# EAGLE schematic Mainboard_3.6 (EAGLE 9.6.2), part 1 of 4
Assembly variants: A, B
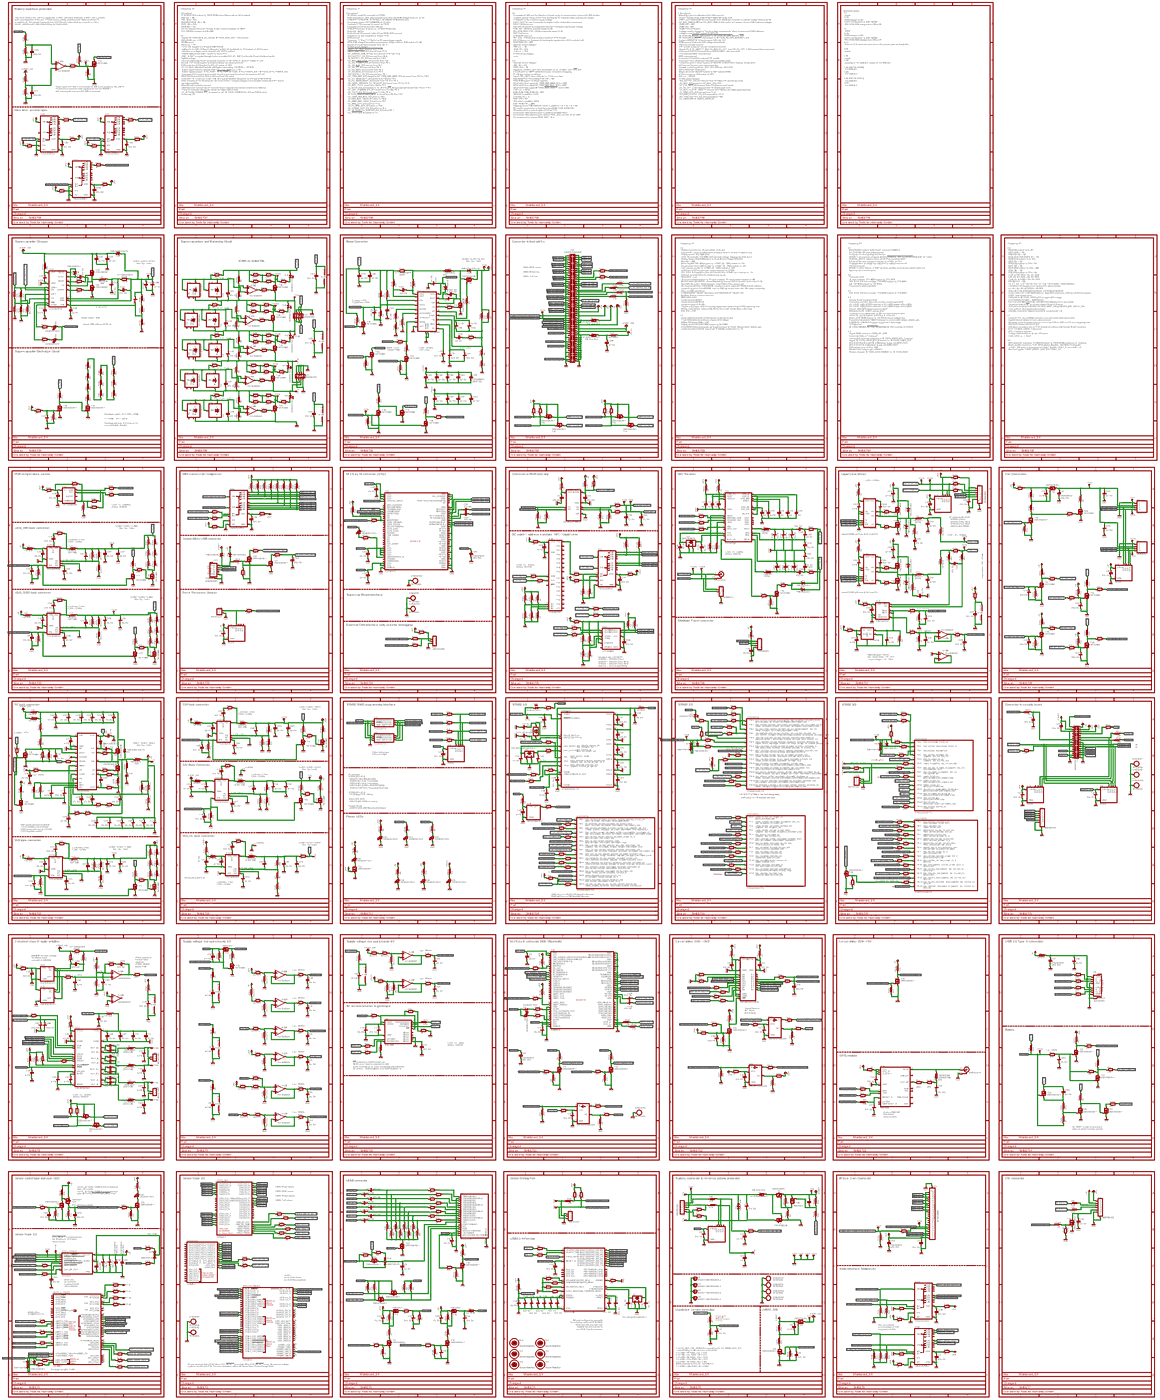
[diagram p0: schematic, sheet 1, overview]
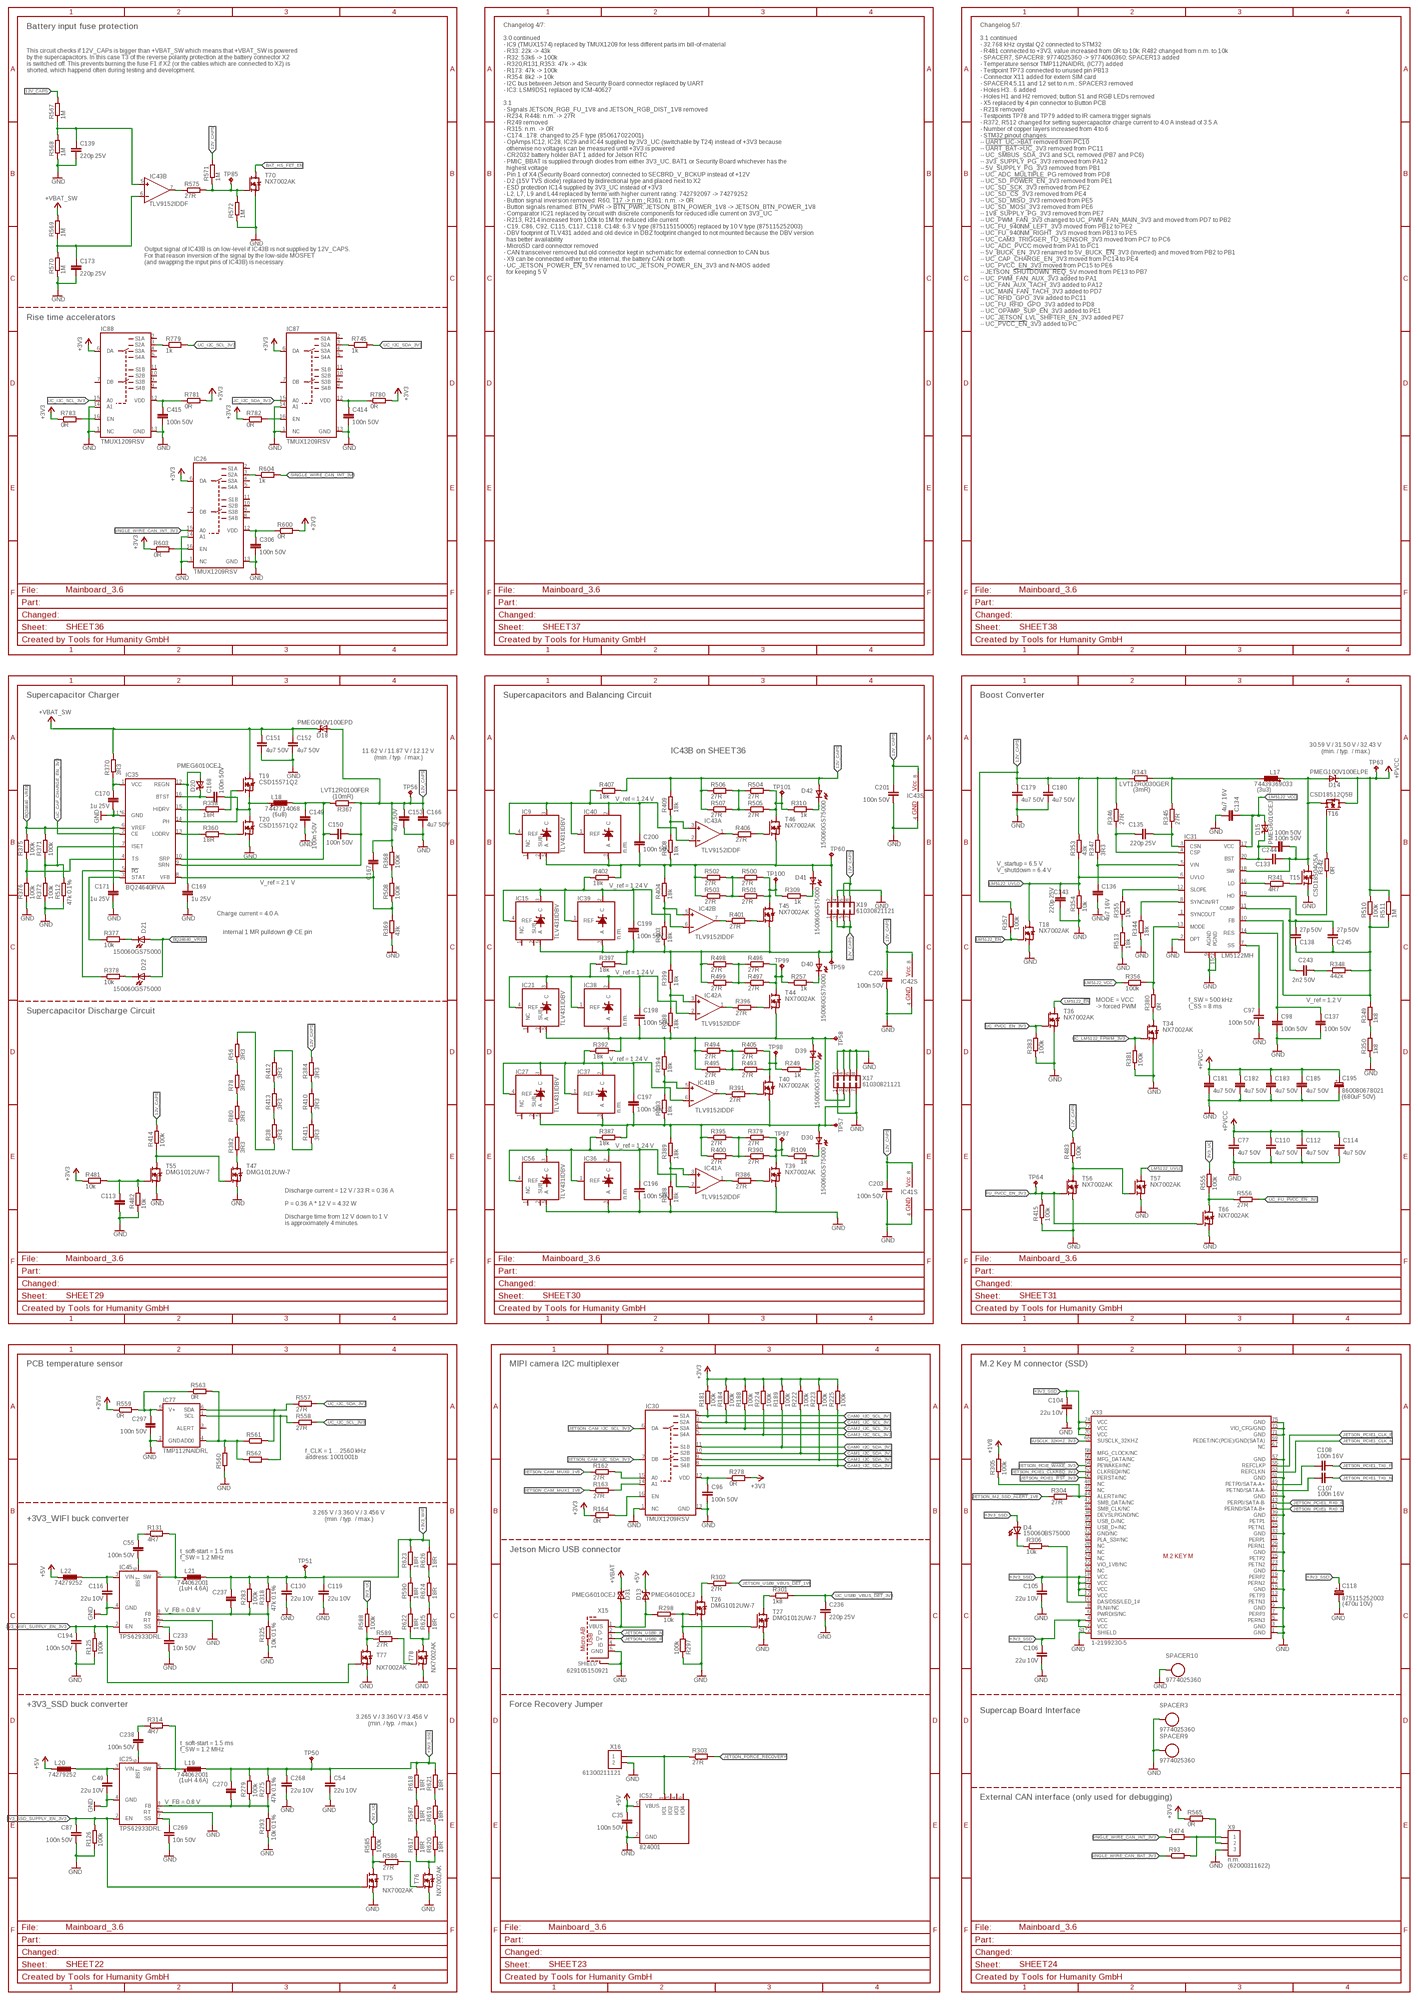
[diagram p1: schematic, sheet 1, part 1 of 4]
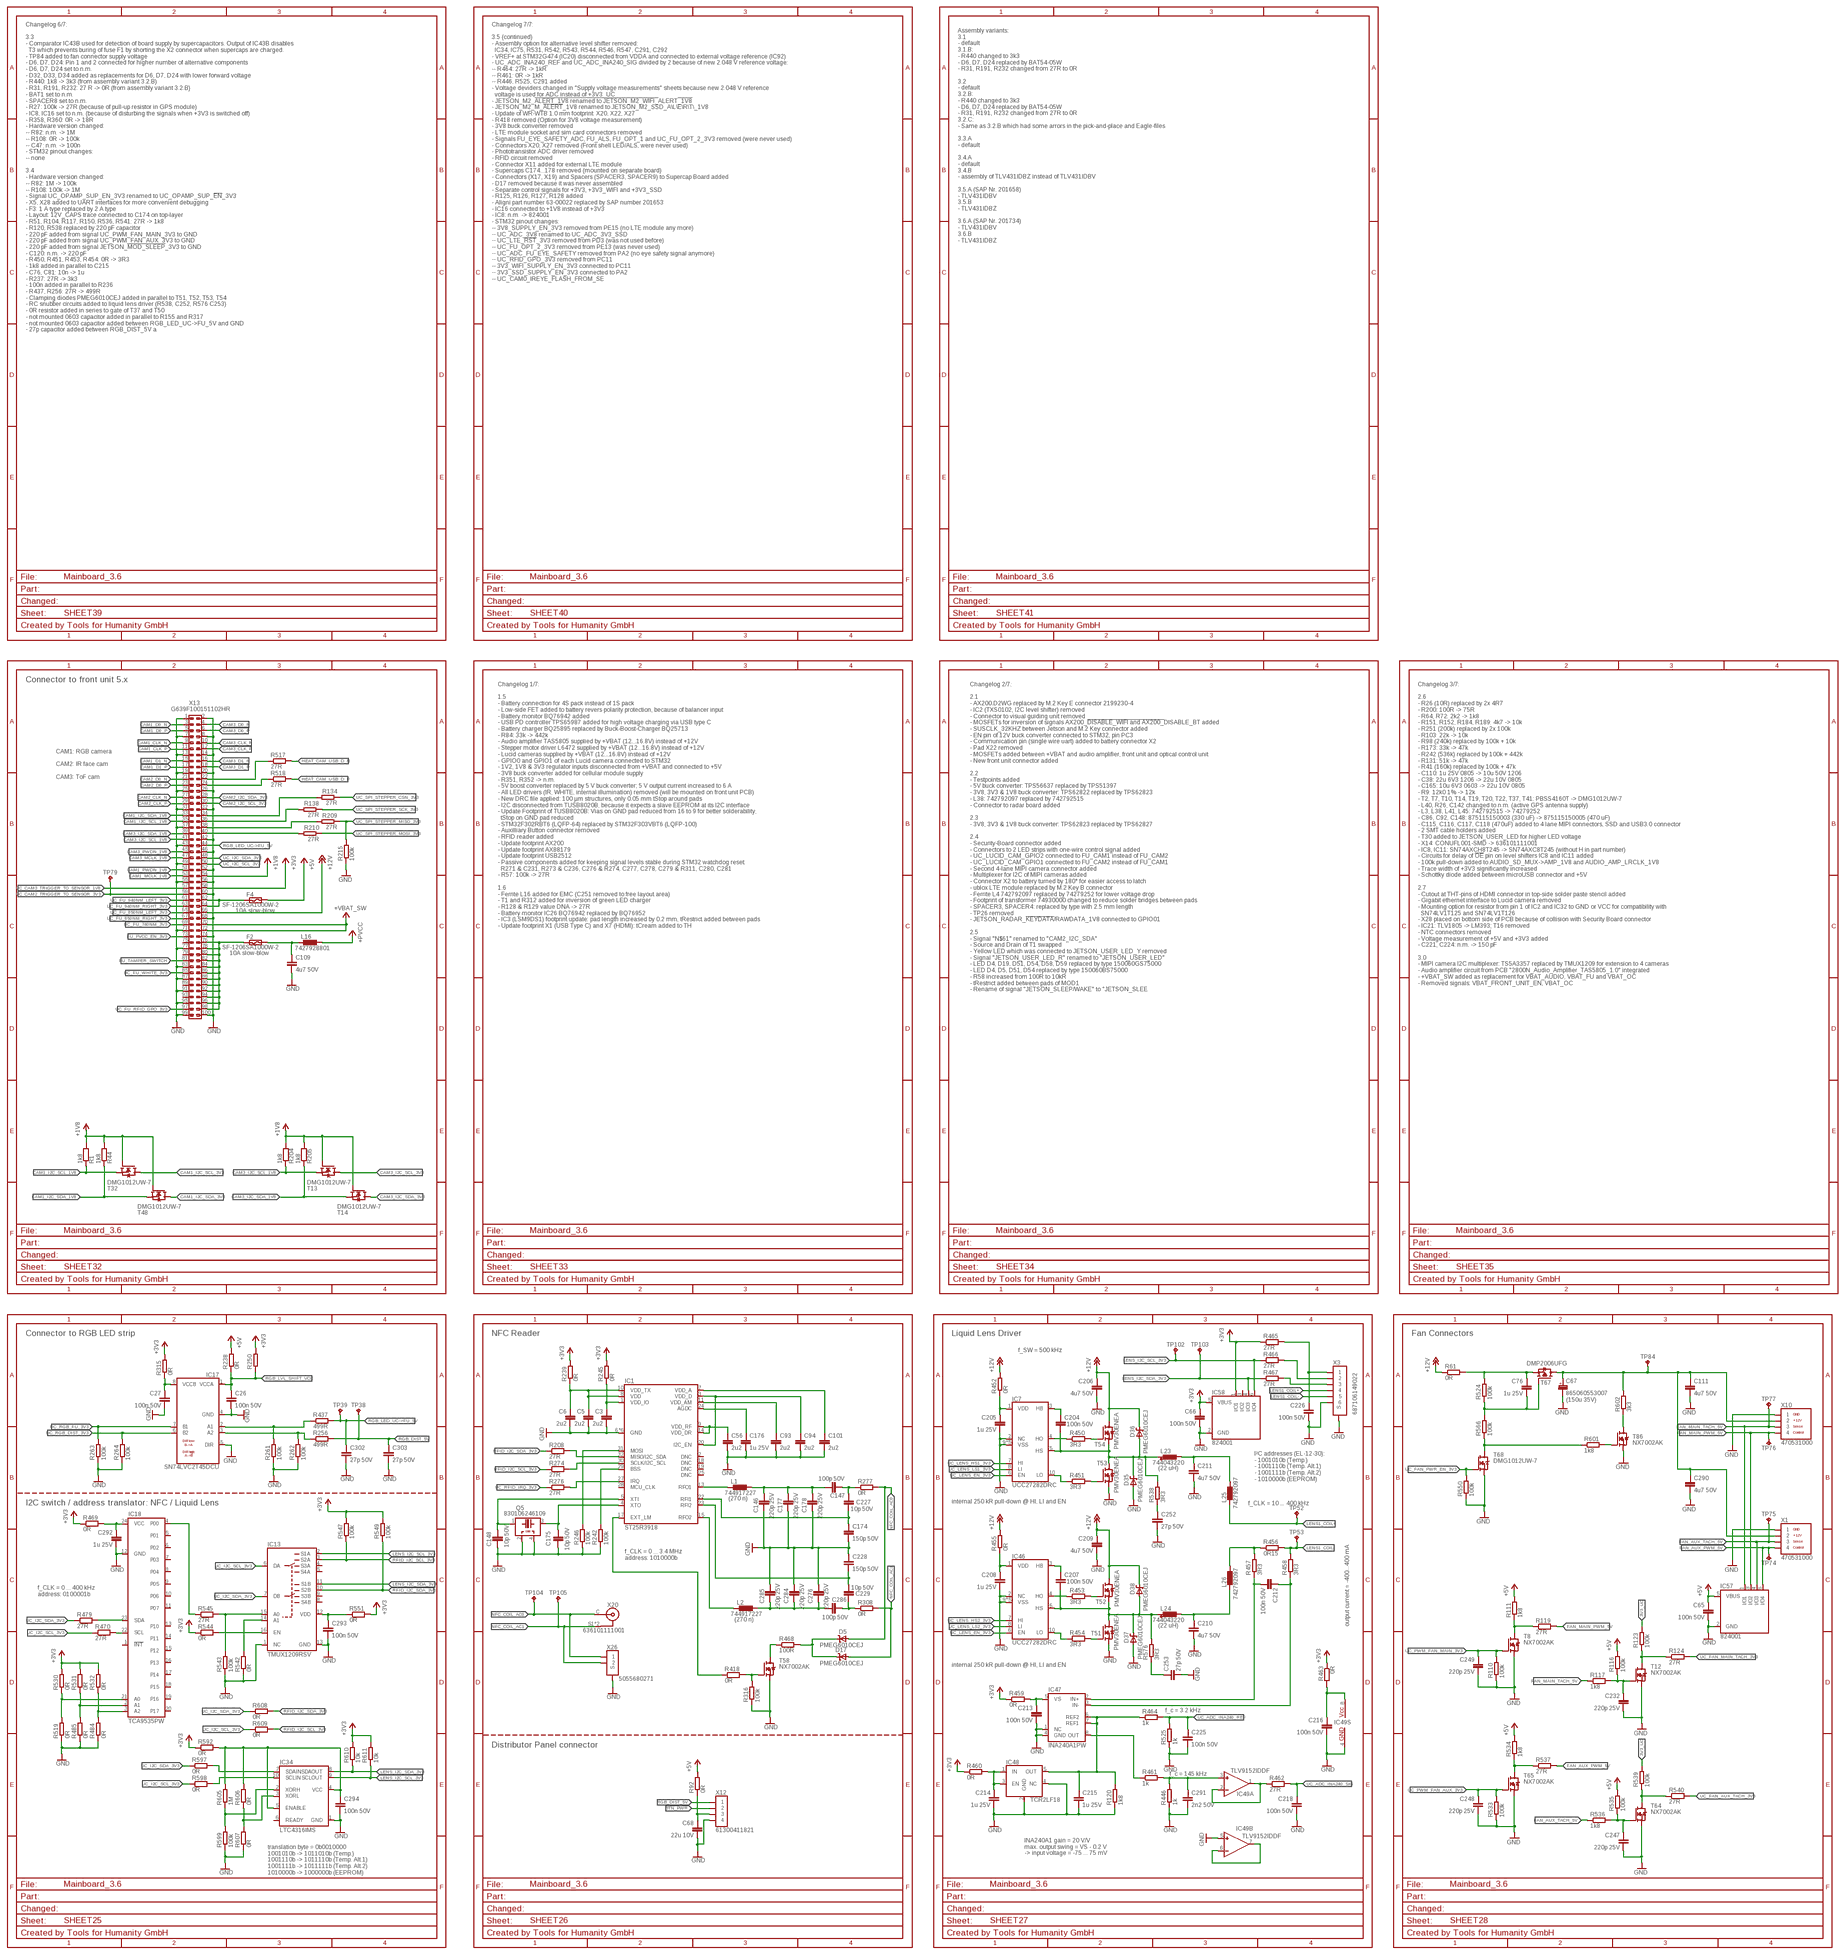
[diagram p2: schematic, sheet 1, part 2 of 4]
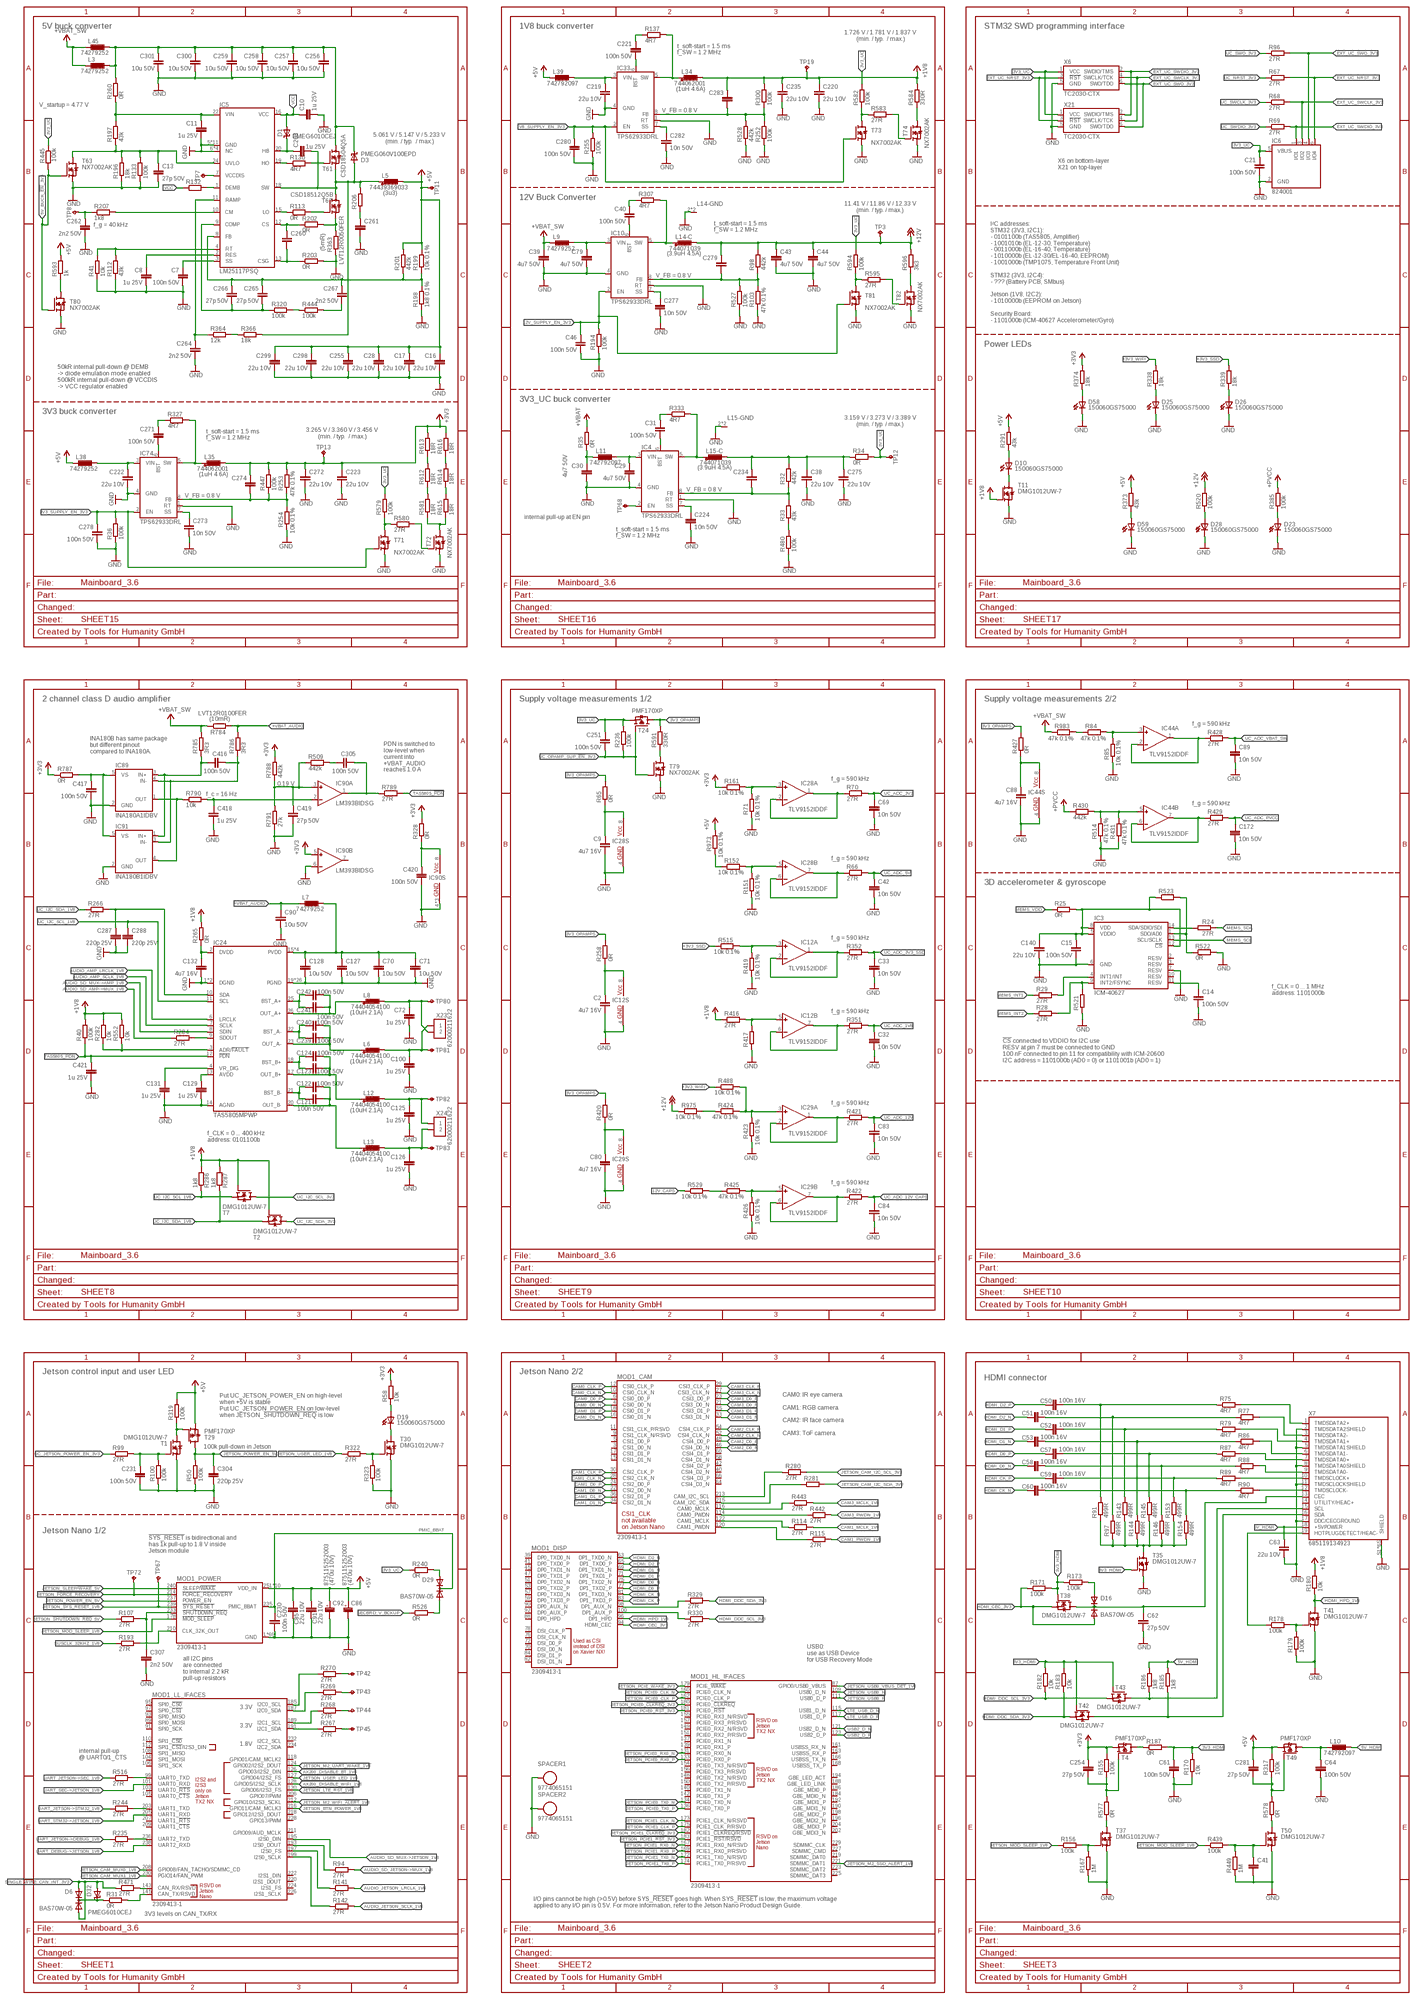
[diagram p3: schematic, sheet 1, part 3 of 4]
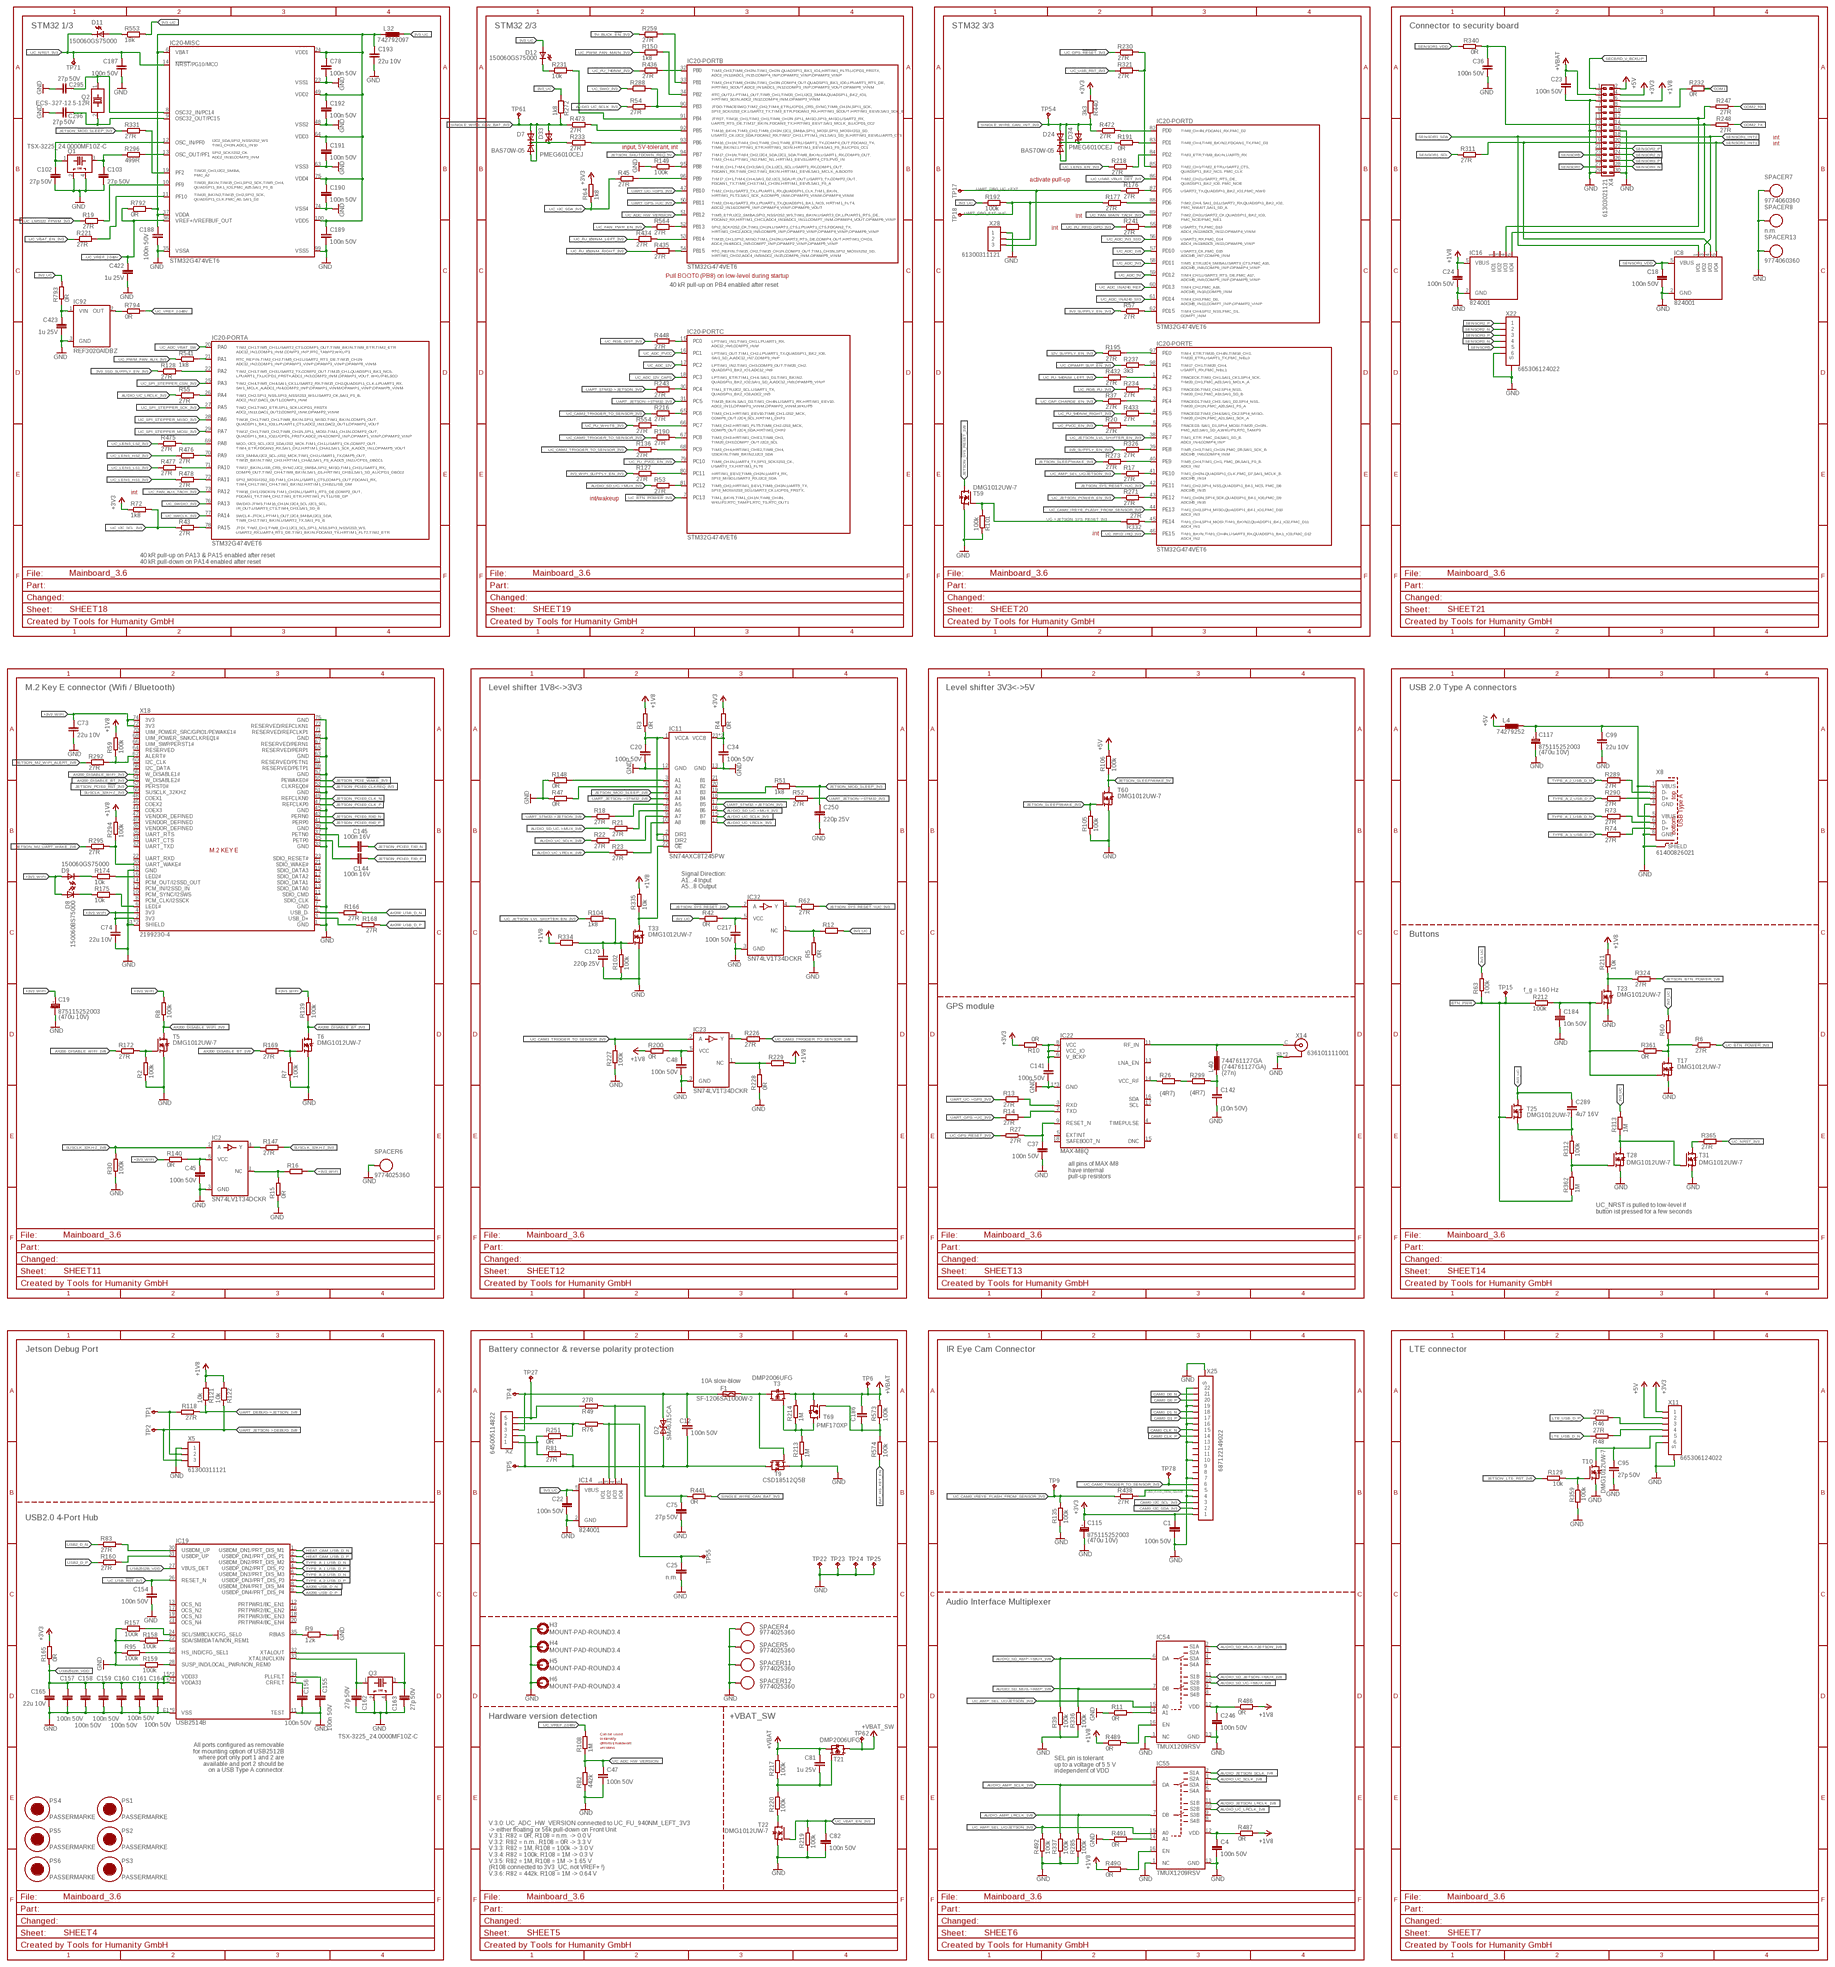
[diagram p4: schematic, sheet 1, part 4 of 4]

## Parts
C1  100n 50V  C-EU-100N-C0603  [C0603]
C2  4u7 16V  C-EU-4U7-C0805  [C0805]
C3  2u2  C-EU-2U2-C0603  [C0603]
C4  100n 50V  C-EU-100N-C0603  [C0603]
C5  2u2  C-EU-2U2-C0603  [C0603]
C6  2u2  C-EU-2U2-C0603  [C0603]
C7  100n 50V  C-EU-100N-C0603  [C0603]
C8  1u 25V  C-EU-1U-C0805  [C0805]
C9  4u7 16V  C-EU-4U7-C0805  [C0805]
C10  1u 25V  C-EU-1U-C0805  [C0805]
C11  1u 25V  C-EU-1U-C0805  [C0805]
C12  100n 50V  C-EU-100N-C0603  [C0603]
C13  27p 50V  C-EU-27P-C0603  [C0603]
C14  100n 50V  C-EU-100N-C0603  [C0603]
C15  100n 50V  C-EU-100N-C0603  [C0603]
C16  22u 10V  C-EU-22U-C0805  [C0805]
C17  22u 10V  C-EU-22U-C0805  [C0805]
C18  100n 50V  C-EU-100N-C0603  [C0603]
C19  875115252003  [WCAP-PSHP_8.0X8.7_WE]
C20  100n 50V  C-EU-100N-C0603  [C0603]
C21  100n 50V  C-EU-100N-C0603  [C0603]
C22  100n 50V  C-EU-100N-C0603  [C0603]
C23  100n 50V  C-EU-100N-C0603  [C0603]
C24  100n 50V  C-EU-100N-C0603  [C0603]
C25  n.m.  C-EU-C0402  [C0402]  (not fitted in variant A)  (not fitted in variant B)
C26  100n 50V  C-EU-100N-C0603  [C0603]
C27  100n 50V  C-EU-100N-C0603  [C0603]
C28  22u 10V  C-EU-22U-C0805  [C0805]
C29  4u7 50V  C-EU-4U7-50V-C1210  [C1210]
C30  4u7 50V  C-EU-4U7-50V-C1210  [C1210]
C31  100n 50V  C-EU-100N-C0603  [C0603]
C32  10n 50V  C-EU-10N-C0603  [C0603]
C33  10n 50V  C-EU-10N-C0603  [C0603]
C34  100n 50V  C-EU-100N-C0603  [C0603]
C35  100n 50V  C-EU-100N-C0603  [C0603]
C36  100n 50V  C-EU-100N-C0603  [C0603]
C37  100n 50V  C-EU-100N-C0603  [C0603]
C38  22u 10V  C-EU-22U-C0805  [C0805]
C39  4u7 50V  C-EU-4U7-50V-C1210  [C1210]
C40  100n 50V  C-EU-100N-C0603  [C0603]
C41  C-EU-C0603  [C0603]  (not fitted in variant A)  (not fitted in variant B)
C42  10n 50V  C-EU-10N-C0603  [C0603]
C43  4u7 50V  C-EU-4U7-50V-C1210  [C1210]
C44  4u7 50V  C-EU-4U7-50V-C1210  [C1210]
C45  100n 50V  C-EU-100N-C0603  [C0603]
C46  100n 50V  C-EU-100N-C0603  [C0603]
C47  100n 50V  C-EU-100N-C0603  [C0603]
C48  100n 50V  C-EU-100N-C0603  [C0603]
C49  22u 10V  C-EU-22U-C0805  [C0805]
C50  100n 16V  C-EU-100N-C0402  [C0402]
C51  100n 16V  C-EU-100N-C0402  [C0402]
C52  100n 16V  C-EU-100N-C0402  [C0402]
C53  100n 16V  C-EU-100N-C0402  [C0402]
C54  22u 10V  C-EU-22U-C0805  [C0805]
C55  100n 50V  C-EU-100N-C0603  [C0603]
C56  2u2  C-EU-2U2-C0603  [C0603]
C57  100n 16V  C-EU-100N-C0402  [C0402]
C58  100n 16V  C-EU-100N-C0402  [C0402]
C59  100n 16V  C-EU-100N-C0402  [C0402]
C60  100n 16V  C-EU-100N-C0402  [C0402]
C61  100n 50V  C-EU-100N-C0603  [C0603]
C62  27p 50V  C-EU-27P-C0603  [C0603]
C63  22u 10V  C-EU-22U-C0805  [C0805]
C64  100n 50V  C-EU-100N-C0603  [C0603]
C65  100n 50V  C-EU-100N-C0603  [C0603]
C66  100n 50V  C-EU-100N-C0603  [C0603]
C67  865060553007  [WCAP-ASLL_8.0X10.5_WE]
C68  22u 10V  C-EU-22U-C0805  [C0805]
C69  10n 50V  C-EU-10N-C0603  [C0603]
C70  10u 50V  C-EU-10U-C1206  [C1206]
C71  10u 50V  C-EU-10U-C1206  [C1206]
C72  1u 25V  C-EU-1U-C0805  [C0805]
C73  22u 10V  C-EU-22U-C0805  [C0805]
C74  22u 10V  C-EU-22U-C0805  [C0805]
C75  27p 50V  C-EU-27P-C0603  [C0603]
C76  1u 25V  C-EU-1U-C0805  [C0805]
C77  4u7 50V  C-EU-4U7-50V-C1210  [C1210]
C78  100n 50V  C-EU-100N-C0603  [C0603]
C79  4u7 50V  C-EU-4U7-50V-C1210  [C1210]
C80  4u7 16V  C-EU-4U7-C0805  [C0805]
C81  1u 25V  C-EU-1U-C0805  [C0805]
C82  100n 50V  C-EU-100N-C0603  [C0603]
C83  10n 50V  C-EU-10N-C0603  [C0603]
C84  10n 50V  C-EU-10N-C0603  [C0603]
C85  22u 10V  C-EU-22U-C0805  [C0805]
C86  875115252003  [WCAP-PSHP_8.0X8.7_WE]
C87  100n 50V  C-EU-100N-C0603  [C0603]
C88  4u7 16V  C-EU-4U7-C0805  [C0805]
C89  10n 50V  C-EU-10N-C0603  [C0603]
C90  10u 50V  C-EU-10U-C1206  [C1206]
C91  22u 10V  C-EU-22U-C0805  [C0805]
C92  875115252003  [WCAP-PSHP_8.0X8.7_WE]
C93  2u2  C-EU-2U2-C0603  [C0603]
C94  2u2  C-EU-2U2-C0603  [C0603]
C95  27p 50V  C-EU-27P-C0603  [C0603]
C96  100n 50V  C-EU-100N-C0603  [C0603]
C97  100n 50V  C-EU-100N-C0603  [C0603]
C98  100n 50V  C-EU-100N-C0603  [C0603]
C99  22u 10V  C-EU-22U-C0805  [C0805]
C100  1u 25V  C-EU-1U-C0805  [C0805]
C101  2u2  C-EU-2U2-C0603  [C0603]
C102  27p 50V  C-EU-27P-C0603  [C0603]
C103  27p 50V  C-EU-27P-C0603  [C0603]
C104  22u 10V  C-EU-22U-C0805  [C0805]
C105  22u 10V  C-EU-22U-C0805  [C0805]
C106  22u 10V  C-EU-22U-C0805  [C0805]
C107  100n 16V  C-EU-100N-C0402  [C0402]
C108  100n 16V  C-EU-100N-C0402  [C0402]
C109  4u7 50V  C-EU-4U7-50V-C1210  [C1210]
C110  4u7 50V  C-EU-4U7-50V-C1210  [C1210]
C111  4u7 50V  C-EU-4U7-50V-C1210  [C1210]
C112  4u7 50V  C-EU-4U7-50V-C1210  [C1210]
C113  C-EU-C0603  [C0603]  (not fitted in variant A)  (not fitted in variant B)
C114  4u7 50V  C-EU-4U7-50V-C1210  [C1210]
C115  875115252003  [WCAP-PSHP_8.0X8.7_WE]
C116  22u 10V  C-EU-22U-C0805  [C0805]
C117  875115252003  [WCAP-PSHP_8.0X8.7_WE]
C118  875115252003  [WCAP-PSHP_8.0X8.7_WE]
C119  22u 10V  C-EU-22U-C0805  [C0805]
C120  220p 25V  C-EU-220P-C0402  [C0402]
C121  100n 50V  C-EU-100N-C0603  [C0603]
C122  100n 50V  C-EU-100N-C0603  [C0603]
C123  100n 50V  C-EU-100N-C0603  [C0603]
C124  100n 50V  C-EU-100N-C0603  [C0603]
C125  1u 25V  C-EU-1U-C0805  [C0805]
C126  1u 25V  C-EU-1U-C0805  [C0805]
C127  10u 50V  C-EU-10U-C1206  [C1206]
C128  10u 50V  C-EU-10U-C1206  [C1206]
C129  1u 25V  C-EU-1U-C0805  [C0805]
C130  22u 10V  C-EU-22U-C0805  [C0805]
C131  1u 25V  C-EU-1U-C0805  [C0805]
C132  4u7 16V  C-EU-4U7-C0805  [C0805]
C133  100n 50V  C-EU-100N-C0603  [C0603]
C134  4u7 16V  C-EU-4U7-C0805  [C0805]
C135  220p 25V  C-EU-220P-C0402  [C0402]
C136  4u7 16V  C-EU-4U7-C0805  [C0805]
C137  100n 50V  C-EU-100N-C0603  [C0603]
C138  27p 50V  C-EU-27P-C0603  [C0603]
C139  220p 25V  C-EU-220P-C0402  [C0402]
C140  22u 10V  C-EU-22U-C0805  [C0805]
C141  100n 50V  C-EU-100N-C0603  [C0603]
C142  C-EU-C0603  [C0603]  (not fitted in variant A)  (not fitted in variant B)
C143  220p 25V  C-EU-220P-C0402  [C0402]
C144  100n 16V  C-EU-100N-C0402  [C0402]
C145  100n 16V  C-EU-100N-C0402  [C0402]
C146  220p 25V  C-EU-220P-C0402  [C0402]
C147  100p 50V  C-EU-100P-C0603  [C0603]
C148  10p 50V  C-EU-10P-C0603  [C0603]
C149  100n 50V  C-EU-100N-C0603  [C0603]
C150  100n 50V  C-EU-100N-C0603  [C0603]
C151  4u7 50V  C-EU-4U7-50V-C1210  [C1210]
C152  4u7 50V  C-EU-4U7-50V-C1210  [C1210]
C153  4u7 50V  C-EU-4U7-50V-C1210  [C1210]
C154  100n 50V  C-EU-100N-C0603  [C0603]
C155  100n 50V  C-EU-100N-C0603  [C0603]
C156  100n 50V  C-EU-100N-C0603  [C0603]
C157  100n 50V  C-EU-100N-C0603  [C0603]
C158  100n 50V  C-EU-100N-C0603  [C0603]
C159  100n 50V  C-EU-100N-C0603  [C0603]
C160  100n 50V  C-EU-100N-C0603  [C0603]
C161  100n 50V  C-EU-100N-C0603  [C0603]
C162  27p 50V  C-EU-27P-C0603  [C0603]
C163  27p 50V  C-EU-27P-C0603  [C0603]
C164  100n 50V  C-EU-100N-C0603  [C0603]
C165  22u 10V  C-EU-22U-C0805  [C0805]
C166  4u7 50V  C-EU-4U7-50V-C1210  [C1210]
C167  C-EU-C0603  [C0603]  (not fitted in variant A)  (not fitted in variant B)
C168  100n 50V  C-EU-100N-C0603  [C0603]
C169  1u 25V  C-EU-1U-C0805  [C0805]
C170  1u 25V  C-EU-1U-C0805  [C0805]
C171  1u 25V  C-EU-1U-C0805  [C0805]
C172  10n 50V  C-EU-10N-C0603  [C0603]
C173  220p 25V  C-EU-220P-C0402  [C0402]
C174  150p 50V  C-EU-150P-C0603  [C0603]
C175  10p 50V  C-EU-10P-C0603  [C0603]
C176  1u 25V  C-EU-1U-C0603  [C0603]
C177  220p 25V  C-EU-220P-C0402  [C0402]
C178  220p 25V  C-EU-220P-C0402  [C0402]
C179  4u7 50V  C-EU-4U7-50V-C1210  [C1210]
C180  4u7 50V  C-EU-4U7-50V-C1210  [C1210]
C181  4u7 50V  C-EU-4U7-50V-C1210  [C1210]
C182  4u7 50V  C-EU-4U7-50V-C1210  [C1210]
C183  4u7 50V  C-EU-4U7-50V-C1210  [C1210]
C184  10n 50V  C-EU-10N-C0603  [C0603]
C185  4u7 50V  C-EU-4U7-50V-C1210  [C1210]
C186  C-EU-C0603  [C0603]  (not fitted in variant A)  (not fitted in variant B)
C187  100n 50V  C-EU-100N-C0603  [C0603]
C188  100n 50V  C-EU-100N-C0603  [C0603]
C189  100n 50V  C-EU-100N-C0603  [C0603]
C190  100n 50V  C-EU-100N-C0603  [C0603]
C191  100n 50V  C-EU-100N-C0603  [C0603]
C192  100n 50V  C-EU-100N-C0603  [C0603]
C193  22u 10V  C-EU-22U-C0805  [C0805]
C194  100n 50V  C-EU-100N-C0603  [C0603]
C195  860080678021  [WCAP-ATLI_13.0X25.0_WE]
C196  100n 50V  C-EU-100N-C0603  [C0603]
C197  100n 50V  C-EU-100N-C0603  [C0603]
C198  100n 50V  C-EU-100N-C0603  [C0603]
C199  100n 50V  C-EU-100N-C0603  [C0603]
C200  100n 50V  C-EU-100N-C0603  [C0603]
C201  100n 50V  C-EU-100N-C0603  [C0603]
C202  100n 50V  C-EU-100N-C0603  [C0603]
C203  100n 50V  C-EU-100N-C0603  [C0603]
C204  100n 50V  C-EU-100N-C0603  [C0603]
C205  1u 25V  C-EU-1U-C0805  [C0805]
C206  4u7 50V  C-EU-4U7-50V-C1210  [C1210]
C207  100n 50V  C-EU-100N-C0603  [C0603]
C208  1u 25V  C-EU-1U-C0805  [C0805]
C209  4u7 50V  C-EU-4U7-50V-C1210  [C1210]
C210  4u7 50V  C-EU-4U7-50V-C1210  [C1210]
C211  4u7 50V  C-EU-4U7-50V-C1210  [C1210]
C212  100n 50V  C-EU-100N-C0603  [C0603]
C213  100n 50V  C-EU-100N-C0603  [C0603]
C214  1u 25V  C-EU-1U-C0805  [C0805]
C215  1u 25V  C-EU-1U-C0805  [C0805]
C216  100n 50V  C-EU-100N-C0603  [C0603]
C217  100n 50V  C-EU-100N-C0603  [C0603]
C218  100n 50V  C-EU-100N-C0603  [C0603]
C219  22u 10V  C-EU-22U-C0805  [C0805]
C220  22u 10V  C-EU-22U-C0805  [C0805]
C221  100n 50V  C-EU-100N-C0603  [C0603]
C222  22u 10V  C-EU-22U-C0805  [C0805]
C223  22u 10V  C-EU-22U-C0805  [C0805]
C224  10n 50V  C-EU-10N-C0603  [C0603]
C225  100n 50V  C-EU-100N-C0603  [C0603]
C226  100n 50V  C-EU-100N-C0603  [C0603]
C227  10p 50V  C-EU-10P-C0603  [C0603]
C228  150p 50V  C-EU-150P-C0603  [C0603]
C229  10p 50V  C-EU-10P-C0603  [C0603]
C230  100n 50V  C-EU-100N-C0603  [C0603]
C231  100n 50V  C-EU-100N-C0603  [C0603]
C232  220p 25V  C-EU-220P-C0402  [C0402]
C233  10n 50V  C-EU-10N-C0603  [C0603]
C234  C-EU-C0603  [C0603]  (not fitted in variant A)  (not fitted in variant B)
C235  22u 10V  C-EU-22U-C0805  [C0805]
C236  220p 25V  C-EU-220P-C0402  [C0402]
C237  C-EU-C0603  [C0603]  (not fitted in variant A)  (not fitted in variant B)
C238  100n 50V  C-EU-100N-C0603  [C0603]
C239  100n 50V  C-EU-100N-C0603  [C0603]
C240  100n 50V  C-EU-100N-C0603  [C0603]
C241  100n 50V  C-EU-100N-C0603  [C0603]
C242  100n 50V  C-EU-100N-C0603  [C0603]
C243  2n2 50V  C-EU-2N2-C0603  [C0603]
C244  100n 50V  C-EU-100N-C0603  [C0603]
C245  27p 50V  C-EU-27P-C0603  [C0603]
C246  100n 50V  C-EU-100N-C0603  [C0603]
C247  220p 25V  C-EU-220P-C0402  [C0402]
C248  220p 25V  C-EU-220P-C0402  [C0402]
C249  220p 25V  C-EU-220P-C0402  [C0402]
C250  220p 25V  C-EU-220P-C0402  [C0402]
C251  100n 50V  C-EU-100N-C0603  [C0603]
C252  27p 50V  C-EU-27P-C0603  [C0603]  (not fitted in variant A)  (not fitted in variant B)
C253  27p 50V  C-EU-27P-C0603  [C0603]  (not fitted in variant A)  (not fitted in variant B)
C254  27p 50V  C-EU-27P-C0603  [C0603]  (not fitted in variant A)  (not fitted in variant B)
C255  22u 10V  C-EU-22U-C0805  [C0805]
C256  10u 50V  C-EU-10U-C1206  [C1206]
C257  10u 50V  C-EU-10U-C1206  [C1206]
C258  10u 50V  C-EU-10U-C1206  [C1206]
C259  10u 50V  C-EU-10U-C1206  [C1206]
C260  C-EU-C0603  [C0603]  (not fitted in variant A)  (not fitted in variant B)
C261  C-EU-C0603  [C0603]  (not fitted in variant A)  (not fitted in variant B)
C262  2n2 50V  C-EU-2N2-C0603  [C0603]
C263  1u 25V  C-EU-1U-C0805  [C0805]
C264  2n2 50V  C-EU-2N2-C0603  [C0603]
C265  27p 50V  C-EU-27P-C0603  [C0603]
C266  27p 50V  C-EU-27P-C0603  [C0603]
C267  2n2 50V  C-EU-2N2-C0603  [C0603]
C268  22u 10V  C-EU-22U-C0805  [C0805]
C269  10n 50V  C-EU-10N-C0603  [C0603]
C270  C-EU-C0603  [C0603]  (not fitted in variant A)  (not fitted in variant B)
C271  100n 50V  C-EU-100N-C0603  [C0603]
C272  22u 10V  C-EU-22U-C0805  [C0805]
C273  10n 50V  C-EU-10N-C0603  [C0603]
C274  C-EU-C0603  [C0603]  (not fitted in variant A)  (not fitted in variant B)
C275  22u 10V  C-EU-22U-C0805  [C0805]
C276  220p 25V  C-EU-220P-C0402  [C0402]
C277  10n 50V  C-EU-10N-C0603  [C0603]
C278  100n 50V  C-EU-100N-C0603  [C0603]
C279  C-EU-C0603  [C0603]  (not fitted in variant A)  (not fitted in variant B)
C280  100n 50V  C-EU-100N-C0603  [C0603]
C281  27p 50V  C-EU-27P-C0603  [C0603]  (not fitted in variant A)  (not fitted in variant B)
C282  10n 50V  C-EU-10N-C0603  [C0603]
C283  C-EU-C0603  [C0603]  (not fitted in variant A)  (not fitted in variant B)
C284  220p 25V  C-EU-220P-C0402  [C0402]
C285  220p 25V  C-EU-220P-C0402  [C0402]
C286  100p 50V  C-EU-100P-C0603  [C0603]
C287  220p 25V  C-EU-220P-C0402  [C0402]
C288  220p 25V  C-EU-220P-C0402  [C0402]
C289  4u7 16V  C-EU-4U7-C0805  [C0805]
C290  4u7 50V  C-EU-4U7-50V-C1210  [C1210]
C291  2n2 50V  C-EU-2N2-C0603  [C0603]
C292  1u 25V  C-EU-1U-C0603  [C0603]  (not fitted in variant A)  (not fitted in variant B)
C293  100n 50V  C-EU-100N-C0603  [C0603]  (not fitted in variant A)  (not fitted in variant B)
C294  100n 50V  C-EU-100N-C0603  [C0603]
C295  27p 50V  C-EU-27P-C0603  [C0603]  (not fitted in variant A)  (not fitted in variant B)
C296  27p 50V  C-EU-27P-C0603  [C0603]  (not fitted in variant A)  (not fitted in variant B)
C297  100n 50V  C-EU-100N-C0603  [C0603]
C298  22u 10V  C-EU-22U-C0805  [C0805]
C299  22u 10V  C-EU-22U-C0805  [C0805]
C300  10u 50V  C-EU-10U-C1206  [C1206]
C301  10u 50V  C-EU-10U-C1206  [C1206]
C302  27p 50V  C-EU-27P-C0603  [C0603]  (not fitted in variant A)  (not fitted in variant B)
C303  27p 50V  C-EU-27P-C0603  [C0603]
C304  220p 25V  C-EU-220P-C0402  [C0402]
C305  100n 50V  C-EU-100N-C0603  [C0603]
C306  100n 50V  C-EU-100N-C0603  [C0603]
C307  2n2 50V  C-EU-2N2-C0603  [C0603]
C414  100n 50V  C-EU-100N-C0603  [C0603]
C415  100n 50V  C-EU-100N-C0603  [C0603]
C416  100n 50V  C-EU-100N-C0603  [C0603]
C417  100n 50V  C-EU-100N-C0603  [C0603]
C418  1u 25V  C-EU-1U-C0805  [C0805]
C419  27p 50V  C-EU-27P-C0603  [C0603]
C420  100n 50V  C-EU-100N-C0603  [C0603]
C421  1u 25V  C-EU-1U-C0805  [C0805]
C422  1u 25V  C-EU-1U-C0805  [C0805]
C423  1u 25V  C-EU-1U-C0805  [C0805]
D1  PMEG6010CEJ  [SOD323F_SC-90_NXP]
D2  SMA6J15CA  [SMA_BI_ST]
D3  PMEG060V100EPD  [CFP15_SOT1289_NXP]
D4  150060BS75000  [WL-SMCW_0603_WE]
D5  PMEG6010CEJ  [SOD323F_SC-90_NXP]  (not fitted in variant A)  (not fitted in variant B)
D6  BAS70W-05  [SOT-323_DIODES_INC]  (not fitted in variant A)  (not fitted in variant B)
D7  BAS70W-05  [SOT-323_DIODES_INC]  (not fitted in variant A)  (not fitted in variant B)
D8  150060BS75000  [WL-SMCW_0603_WE]
D9  150060GS75000  [WL-SMCW_0603_WE]
D10  150060GS75000  [WL-SMCW_0603_WE]
D11  150060GS75000  [WL-SMCW_0603_WE]
D12  150060GS75000  [WL-SMCW_0603_WE]
D13  PMEG6010CEJ  [SOD323F_SC-90_NXP]  (not fitted in variant A)  (not fitted in variant B)
D14  PMEG100V100ELPE  [CFP15B_SOT1289B_NXP]
D15  PMEG6010CEJ  [SOD323F_SC-90_NXP]
D16  BAS70W-05  [SOT-323_DIODES_INC]
D17  PMEG6010CEJ  [SOD323F_SC-90_NXP]  (not fitted in variant A)  (not fitted in variant B)
D18  PMEG060V100EPD  [CFP15_SOT1289_NXP]
D19  150060GS75000  [WL-SMCW_0603_WE]
D20  PMEG6010CEJ  [SOD323F_SC-90_NXP]
D21  150060GS75000  [WL-SMCW_0603_WE]
D22  150060GS75000  [WL-SMCW_0603_WE]
D23  150060GS75000  [WL-SMCW_0603_WE]
D24  BAS70W-05  [SOT-323_DIODES_INC]  (not fitted in variant A)  (not fitted in variant B)
D25  150060GS75000  [WL-SMCW_0603_WE]
D26  150060GS75000  [WL-SMCW_0603_WE]
D28  150060GS75000  [WL-SMCW_0603_WE]
D29  BAS70W-05  [SOT-323_DIODES_INC]
D30  150060GS75000  [WL-SMCW_0603_WE]
D31  PMEG6010CEJ  [SOD323F_SC-90_NXP]  (not fitted in variant A)  (not fitted in variant B)
D32  PMEG6010CEJ  [SOD323F_SC-90_NXP]
D33  PMEG6010CEJ  [SOD323F_SC-90_NXP]
D34  PMEG6010CEJ  [SOD323F_SC-90_NXP]
D35  PMEG6010CEJ  [SOD323F_SC-90_NXP]
D36  PMEG6010CEJ  [SOD323F_SC-90_NXP]
D37  PMEG6010CEJ  [SOD323F_SC-90_NXP]
D38  PMEG6010CEJ  [SOD323F_SC-90_NXP]
D39  150060GS75000  [WL-SMCW_0603_WE]
D40  150060GS75000  [WL-SMCW_0603_WE]
D41  150060GS75000  [WL-SMCW_0603_WE]
D42  150060GS75000  [WL-SMCW_0603_WE]
D58  150060GS75000  [WL-SMCW_0603_WE]
D59  150060GS75000  [WL-SMCW_0603_WE]
F1  SF-1206SA1000W-2  [SF-1206SA_BOURNS]
F2  SF-1206SA1000W-2  [SF-1206SA_BOURNS]
F4  SF-1206SA1000W-2  [SF-1206SA_BOURNS]
H3  MOUNT-PAD-ROUND3.4  [3,4-PAD]
H4  MOUNT-PAD-ROUND3.4  [3,4-PAD]
H5  MOUNT-PAD-ROUND3.4  [3,4-PAD]
H6  MOUNT-PAD-ROUND3.4  [3,4-PAD]
IC1  ST25R3918  ST25R3918-AQWT  [VFQFPN32_ST]
IC2  SN74LV1T34DCKR  [R-PDSO-G5_DCK_TI]
IC3  ICM-40627  [LGA-14_2.5X3.0_TDK]
IC4  TPS62933DRL  [DRL0008A_TI]
IC5  LM25117PSQ  [S-PWQFN-N24_RTW_TI]
IC6  824001  [SOT23-6L_WE]
IC7  UCC27282DRC  [DRC0010J_TI]
IC8  824001  [SOT23-6L_WE]
IC9  TLV431IDBV  [DBV0005A_TI]  (not fitted in variant B)
IC10  TPS62933DRL  [DRL0008A_TI]
IC11  SN74AXC8T245PW  [PW0024A_TSSOP_TI]
IC12  TLV9152IDDF  [DDF0008A_TI]
IC13  TMUX1209RSV  [RSV0016A_TI]  (not fitted in variant A)  (not fitted in variant B)
IC14  824001  [SOT23-6L_WE]
IC15  TLV431IDBV  [DBV0005A_TI]  (not fitted in variant B)
IC16  824001  [SOT23-6L_WE]  (not fitted in variant A)  (not fitted in variant B)
IC17  SN74LVC2T45DCU  [S-PDSO-G8_DCU_TI]
IC18  TCA9535PW  [PW0024A_TSSOP_TI]  (not fitted in variant A)  (not fitted in variant B)
IC19  USB2514B  [SQFN36_6X6_MCP]
IC20  STM32G474VET6  [LQFP100_STM]
IC21  TLV431IDBV  [DBV0005A_TI]  (not fitted in variant B)
IC22  MAX-M8Q  [MAX-8_MAX-M8_UBLOX]
IC23  SN74LV1T34DCKR  [R-PDSO-G5_DCK_TI]
IC24  TAS5805MPWP  [PWP0028M_TI]
IC25  TPS62933DRL  [DRL0008A_TI]
IC26  TMUX1209RSV  [RSV0016A_TI]
IC27  TLV431IDBV  [DBV0005A_TI]  (not fitted in variant B)
IC28  TLV9152IDDF  [DDF0008A_TI]
IC29  TLV9152IDDF  [DDF0008A_TI]
IC30  TMUX1209RSV  [RSV0016A_TI]
IC31  LM5122MH  [PWP0020A_TI]
IC32  SN74LV1T34DCKR  [R-PDSO-G5_DCK_TI]
IC33  TPS62933DRL  [DRL0008A_TI]
IC34  LTC4316IMS  LTC4316IMS#PBF  [MS_10-LEAD_MSOP_LT]
IC35  BQ24640RVA  [S-PVQFN-N16_RVA_TI]
IC36  n.m.  TLV431IDBZ  [DBZ0003A_TI]  (not fitted in variant A)  (variant B: TLV431IDBZ)
IC37  n.m.  TLV431IDBZ  [DBZ0003A_TI]  (not fitted in variant A)  (variant B: TLV431IDBZ)
IC38  n.m.  TLV431IDBZ  [DBZ0003A_TI]  (not fitted in variant A)  (variant B: TLV431IDBZ)
IC39  n.m.  TLV431IDBZ  [DBZ0003A_TI]  (not fitted in variant A)  (variant B: TLV431IDBZ)
IC40  n.m.  TLV431IDBZ  [DBZ0003A_TI]  (not fitted in variant A)  (variant B: TLV431IDBZ)
IC41  TLV9152IDDF  [DDF0008A_TI]
IC42  TLV9152IDDF  [DDF0008A_TI]
IC43  TLV9152IDDF  [DDF0008A_TI]
IC44  TLV9152IDDF  [DDF0008A_TI]
IC45  TPS62933DRL  [DRL0008A_TI]
IC46  UCC27282DRC  [DRC0010J_TI]
IC47  INA240A1PW  [PW0008A_TSSOP_TI]
IC48  TCR2LF18  [SOT-25-5_SC-74A_TOSHIBA]
IC49  TLV9152IDDF  [DDF0008A_TI]
IC52  824001  [SOT23-6L_WE]
IC54  TMUX1209RSV  [RSV0016A_TI]
IC55  TMUX1209RSV  [RSV0016A_TI]
IC56  TLV431IDBV  [DBV0005A_TI]  (not fitted in variant B)
IC57  824001  [SOT23-6L_WE]
IC58  824001  [SOT23-6L_WE]
IC74  TPS62933DRL  [DRL0008A_TI]
IC77  TMP112NAIDRL  [DRL0006A_TI]
IC87  TMUX1209RSV  [RSV0016A_TI]
IC88  TMUX1209RSV  [RSV0016A_TI]
IC89  INA180A1IDBV  [DBV0005A_TI]
IC90  LM393BIDSG  [DSG0008A_WSON_TI]
IC91  INA180B1IDBV  [DBV0005A_TI]  (not fitted in variant A)  (not fitted in variant B)
IC92  REF3020AIDBZ  [DBZ0003A_TI]
L1  744917227  [WE-KI_0603_WUERTH]
L2  744917227  [WE-KI_0603_WUERTH]
L3  74279252  [FERRIT_1812_WUERTH]
L4  74279252  [FERRIT_1812_WUERTH]
L5  74439369033  [WE-XHMI_1090_WE]
L6  74404054100  [WE-LQS_5040_WE]
L7  74279252  [FERRIT_1812_WUERTH]
L8  74404054100  [WE-LQS_5040_WE]
L9  74279252  [FERRIT_1812_WUERTH]
L10  742792097  [FERRIT_0805_WUERTH]
L11  742792097  [FERRIT_0805_WUERTH]
L12  74404054100  [WE-LQS_5040_WE]
L13  74404054100  [WE-LQS_5040_WE]
L14  744071039  [WE-TPC_8043_WE]
L15  744071039  [WE-TPC_8043_WE]
L16  7427928801  [WE-CBF_2220_WUERTH]
L17  74439369033  [WE-XHMI_1090_WE]
L18  7447714068  [WE-PD_1050_WE]
L19  744062001  [WE-TPC_6823_WE]
L20  74279252  [FERRIT_1812_WUERTH]
L21  744062001  [WE-TPC_6823_WE]
L22  74279252  [FERRIT_1812_WUERTH]
L23  744043220  [WE-TPC_4828_WE]
L24  744043220  [WE-TPC_4828_WE]
L25  742792097  [FERRIT_0805_WUERTH]
L26  742792097  [FERRIT_0805_WUERTH]
L32  742792097  [FERRIT_0805_WUERTH]
L34  744062001  [WE-TPC_6823_WE]
L35  744062001  [WE-TPC_6823_WE]
L38  74279252  [FERRIT_1812_WUERTH]
L39  742792097  [FERRIT_0805_WUERTH]
L40  744761127GA  [WE-KI_0603_WUERTH]  (not fitted in variant A)  (not fitted in variant B)
L45  74279252  [FERRIT_1812_WUERTH]
MOD1  2309413-1  JETSON_NANO_TX2_NX_XAVIER_NX  [2309413_JETSON_NANO_TE]
PS1  PASSERMARKE  [PASSERMARKE]
PS2  PASSERMARKE  [PASSERMARKE]
PS3  PASSERMARKE  [PASSERMARKE]
PS4  PASSERMARKE  [PASSERMARKE]
PS5  PASSERMARKE  [PASSERMARKE]
PS6  PASSERMARKE  [PASSERMARKE]
Q1  TSX-3225_24.0000MF10Z-C  [TSX-3225_SEIKO_EPSON]
Q2  ECS-.327-12.5-12R  [ECX-12R_ECS]
Q3  TSX-3225_24.0000MF10Z-C  [TSX-3225_SEIKO_EPSON]
Q5  830106246109  [TSX-3225_SEIKO_EPSON]
R1  1k8  R-EU-1K8-R0603  [R0603]
R2  100k  R-EU-100K-R0603  [R0603]
R3  0R  R-EU-0R-R0603  [R0603]
R4  0R  R-EU-0R-R0603  [R0603]
R5  0R  R-EU-0R-R0603  [R0603]
R6  27R  R-EU-27R-R0603  [R0603]
R7  100k  R-EU-100K-R0603  [R0603]
R8  100k  R-EU-100K-R0603  [R0603]
R9  12k  R-EU-12K-R0603  [R0603]
R10  0R  R-EU-0R-R0603  [R0603]
R11  0R  R-EU-0R-R0603  [R0603]
R12  R-EU-R0603  [R0603]  (not fitted in variant A)  (not fitted in variant B)
R13  27R  R-EU-27R-R0603  [R0603]
R14  27R  R-EU-27R-R0603  [R0603]
R15  0R  R-EU-0R-R0603  [R0603]
R16  R-EU-R0603  [R0603]  (not fitted in variant A)  (not fitted in variant B)
R17  27R  R-EU-27R-R0603  [R0603]
R18  27R  R-EU-27R-R0603  [R0603]
R19  27R  R-EU-27R-R0603  [R0603]
R20  27R  R-EU-27R-R0603  [R0603]
R21  27R  R-EU-27R-R0603  [R0603]
R22  27R  R-EU-27R-R0603  [R0603]
R23  27R  R-EU-27R-R0603  [R0603]
R24  27R  R-EU-27R-R0603  [R0603]
R25  0R  R-EU-0R-R0603  [R0603]
R26  R-EU-R0402  [R0402]  (not fitted in variant A)  (not fitted in variant B)
R27  27R  R-EU-27R-R0603  [R0603]
R28  27R  R-EU-27R-R0603  [R0603]
R29  27R  R-EU-27R-R0603  [R0603]
R30  100k  R-EU-100K-R0603  [R0603]
R31  0R  R-EU-0R-R0603  [R0603]
R32  442k  R-EU-442K-R0603  [R0603]
R33  43k  R-EU-43K-R0603  [R0603]
R34  0R  R-EU-0R-R0603  [R0603]
R35  0R  R-EU-0R-R0603  [R0603]
R36  100k  R-EU-100K-R0603  [R0603]
R37  27R  R-EU-27R-R0603  [R0603]
R38  3R3  R-EU-3R3-R1210  [R1210]
R39  100k  R-EU-100K-R0603  [R0603]
R40  100k  R-EU-100K-R0603  [R0603]
R41  10k  R-EU-10K-R0603  [R0603]
R42  0R  R-EU-0R-R0603  [R0603]
R43  27R  R-EU-27R-R0603  [R0603]
R44  1k8  R-EU-1K8-R0603  [R0603]
R45  27R  R-EU-27R-R0603  [R0603]
R46  27R  R-EU-27R-R0603  [R0603]
R47  0R  R-EU-0R-R0603  [R0603]
R48  27R  R-EU-27R-R0603  [R0603]
R49  27R  R-EU-27R-R0603  [R0603]
R50  100k  R-EU-100K-R0603  [R0603]
R51  1k8  R-EU-1K8-R0603  [R0603]
R52  27R  R-EU-27R-R0603  [R0603]
R53  27R  R-EU-27R-R0603  [R0603]
R54  27R  R-EU-27R-R0603  [R0603]
R55  27R  R-EU-27R-R0603  [R0603]
R56  3R3  R-EU-3R3-R1210  [R1210]
R57  27R  R-EU-27R-R0603  [R0603]
R58  10k  R-EU-10K-R0603  [R0603]
R59  100k  R-EU-100K-R0603  [R0603]
R60  R-EU-R0603  [R0603]  (not fitted in variant A)  (not fitted in variant B)
R61  0R  R-EU-0R-R0603  [R0603]
R62  27R  R-EU-27R-R0603  [R0603]
R63  100k  R-EU-100K-R0603  [R0603]
R64  1k8  R-EU-1K8-R0603  [R0603]
R65  0R  R-EU-0R-R0603  [R0603]
R66  27R  R-EU-27R-R0603  [R0603]
R67  27R  R-EU-27R-R0603  [R0603]
R68  27R  R-EU-27R-R0603  [R0603]
R69  27R  R-EU-27R-R0603  [R0603]
R70  27R  R-EU-27R-R0603  [R0603]
R71  10k 0.1%  R-EU-10K-0P1-R0603  [R0603]
R72  1k8  R-EU-1K8-R0603  [R0603]
R73  27R  R-EU-27R-R0603  [R0603]
R74  27R  R-EU-27R-R0603  [R0603]
R75  4R7  R-EU-4R7-R0402  [R0402]
R76  R-EU-R0603  [R0603]  (not fitted in variant A)  (not fitted in variant B)
R77  4R7  R-EU-4R7-R0402  [R0402]
R78  3R3  R-EU-3R3-R1210  [R1210]
R79  4R7  R-EU-4R7-R0402  [R0402]
R80  3R3  R-EU-3R3-R1210  [R1210]
R81  27R  R-EU-27R-R0603  [R0603]  (not fitted in variant A)  (not fitted in variant B)
R82  442k  R-EU-442K-R0603  [R0603]
R83  27R  R-EU-27R-R0603  [R0603]
R84  47k 0.1%  R-EU-47K-0P1-R0603  [R0603]
R85  10k 0.1%  R-EU-10K-0P1-R0603  [R0603]
R86  4R7  R-EU-4R7-R0402  [R0402]
R87  4R7  R-EU-4R7-R0402  [R0402]
R88  4R7  R-EU-4R7-R0402  [R0402]
R89  4R7  R-EU-4R7-R0402  [R0402]
R90  4R7  R-EU-4R7-R0402  [R0402]
R91  499R  R-EU-499R-R0402  [R0402]
R92  0R  R-EU-0R-R0603  [R0603]
R93  R-EU-R0603  [R0603]  (not fitted in variant A)  (not fitted in variant B)
R94  27R  R-EU-27R-R0603  [R0603]
R95  100k  R-EU-100K-R0603  [R0603]
R96  27R  R-EU-27R-R0603  [R0603]
R97  499R  R-EU-499R-R0402  [R0402]
R98  442k  R-EU-442K-R0603  [R0603]
R99  27R  R-EU-27R-R0603  [R0603]
R100  100k  R-EU-100K-R0603  [R0603]
R101  100k  R-EU-100K-R0603  [R0603]
R102  100k  R-EU-100K-R0603  [R0603]
R103  47k 0.1%  R-EU-47K-0P1-R0603  [R0603]
R104  1k8  R-EU-1K8-R0603  [R0603]
R105  100k  R-EU-100K-R0603  [R0603]
R106  100k  R-EU-100K-R0603  [R0603]
R107  27R  R-EU-27R-R0603  [R0603]
R108  1M  R-EU-1M-R0603  [R0603]
R109  1k  R-EU-1K-R0603  [R0603]
R110  100k  R-EU-100K-R0603  [R0603]
R111  1k8  R-EU-1K8-R0603  [R0603]
R112  43k  R-EU-43K-R0603  [R0603]
R113  0R  R-EU-0R-R0603  [R0603]
R114  27R  R-EU-27R-R0603  [R0603]
R115  27R  R-EU-27R-R0603  [R0603]
R116  100k  R-EU-100K-R0603  [R0603]
R117  1k8  R-EU-1K8-R0603  [R0603]
R118  27R  R-EU-27R-R0603  [R0603]
R119  27R  R-EU-27R-R0603  [R0603]
R120  1k8  R-EU-1K8-R0603  [R0603]
R121  10k  R-EU-10K-R0603  [R0603]
R122  10k  R-EU-10K-R0603  [R0603]
R123  100k  R-EU-100K-R0603  [R0603]
R124  27R  R-EU-27R-R0603  [R0603]
R125  100k  R-EU-100K-R0603  [R0603]
R126  100k  R-EU-100K-R0603  [R0603]
R127  27R  R-EU-27R-R0603  [R0603]
R128  27R  R-EU-27R-R0603  [R0603]
R129  10k  R-EU-10K-R0603  [R0603]
R130  4R7  R-EU-4R7-R0402  [R0402]
R131  4R7  R-EU-4R7-R0402  [R0402]
R132  R-EU-R0603  [R0603]  (not fitted in variant A)  (not fitted in variant B)
R133  100k  R-EU-100K-R0603  [R0603]
R134  27R  R-EU-27R-R0603  [R0603]
R135  100k  R-EU-100K-R0603  [R0603]
R136  27R  R-EU-27R-R0603  [R0603]
R137  4R7  R-EU-4R7-R0402  [R0402]
R138  27R  R-EU-27R-R0603  [R0603]
R139  100k  R-EU-100K-R0603  [R0603]
R140  0R  R-EU-0R-R0603  [R0603]
R141  27R  R-EU-27R-R0603  [R0603]
R142  27R  R-EU-27R-R0603  [R0603]
R143  499R  R-EU-499R-R0402  [R0402]
R144  499R  R-EU-499R-R0402  [R0402]
R145  499R  R-EU-499R-R0402  [R0402]
R146  499R  R-EU-499R-R0402  [R0402]
R147  27R  R-EU-27R-R0603  [R0603]
R148  0R  R-EU-0R-R0603  [R0603]
R149  100k  R-EU-100K-R0603  [R0603]
R150  1k8  R-EU-1K8-R0603  [R0603]
R151  10k 0.1%  R-EU-10K-0P1-R0603  [R0603]
R152  10k 0.1%  R-EU-10K-0P1-R0603  [R0603]
R153  499R  R-EU-499R-R0402  [R0402]
R154  499R  R-EU-499R-R0402  [R0402]
R155  100k  R-EU-100K-R0603  [R0603]
R156  100k  R-EU-100K-R0603  [R0603]
R157  100k  R-EU-100K-R0603  [R0603]
R158  100k  R-EU-100K-R0603  [R0603]
R159  100k  R-EU-100K-R0603  [R0603]
R160  27R  R-EU-27R-R0603  [R0603]
R161  10k 0.1%  R-EU-10K-0P1-R0603  [R0603]
R162  27R  R-EU-27R-R0603  [R0603]
R163  27R  R-EU-27R-R0603  [R0603]
R164  0R  R-EU-0R-R0603  [R0603]
R165  0R  R-EU-0R-R0603  [R0603]
R166  27R  R-EU-27R-R0603  [R0603]
R167  1M  R-EU-1M-R0603  [R0603]
R168  27R  R-EU-27R-R0603  [R0603]
R169  27R  R-EU-27R-R0603  [R0603]
R170  10k  R-EU-10K-R0603  [R0603]
R171  100k  R-EU-100K-R0603  [R0603]
R172  27R  R-EU-27R-R0603  [R0603]
R173  100k  R-EU-100K-R0603  [R0603]
R174  10k  R-EU-10K-R0603  [R0603]
R175  10k  R-EU-10K-R0603  [R0603]
R176  27R  R-EU-27R-R0603  [R0603]
R177  27R  R-EU-27R-R0603  [R0603]
R178  100k  R-EU-100K-R0603  [R0603]
R179  100k  R-EU-100K-R0603  [R0603]
R180  10k  R-EU-10K-R0603  [R0603]
R181  100k  R-EU-100K-R0603  [R0603]
R182  10k  R-EU-10K-R0603  [R0603]
R183  10k  R-EU-10K-R0603  [R0603]
R184  100k  R-EU-100K-R0603  [R0603]
R185  1k8  R-EU-1K8-R0603  [R0603]
R186  1k8  R-EU-1K8-R0603  [R0603]
R187  0R  R-EU-0R-R0603  [R0603]
R188  100k  R-EU-100K-R0603  [R0603]
R189  100k  R-EU-100K-R0603  [R0603]
R190  27R  R-EU-27R-R0603  [R0603]
R191  0R  R-EU-0R-R0603  [R0603]
R192  100k  R-EU-100K-R0603  [R0603]
R193  27R  R-EU-27R-R0603  [R0603]
R194  100k  R-EU-100K-R0603  [R0603]
R195  27R  R-EU-27R-R0603  [R0603]
R196  18k  R-EU-18K-R0603  [R0603]
R197  43k  R-EU-43K-R0603  [R0603]
R198  1k8 0.1%  R-EU-1K8-0P1-R0603  [R0603]
R199  10k 0.1%  R-EU-10K-0P1-R0603  [R0603]
R200  0R  R-EU-0R-R0603  [R0603]
R201  442k  R-EU-442K-R0603  [R0603]
R202  0R  R-EU-0R-R0603  [R0603]
R203  0R  R-EU-0R-R0603  [R0603]
R204  1k8  R-EU-1K8-R0603  [R0603]
R205  1k8  R-EU-1K8-R0603  [R0603]
R206  R-EU-R0603  [R0603]  (not fitted in variant A)  (not fitted in variant B)
R207  1k8  R-EU-1K8-R0603  [R0603]
R208  27R  R-EU-27R-R0603  [R0603]
R209  27R  R-EU-27R-R0603  [R0603]
R210  27R  R-EU-27R-R0603  [R0603]
R211  10k  R-EU-10K-R0603  [R0603]
R212  100k  R-EU-100K-R0603  [R0603]
R213  1M  R-EU-1M-R0603  [R0603]
R214  1M  R-EU-1M-R0603  [R0603]
R215  100k  R-EU-100K-R0603  [R0603]
R216  27R  R-EU-27R-R0603  [R0603]
R217  100k  R-EU-100K-R0603  [R0603]
R218  27R  R-EU-27R-R0603  [R0603]
R219  100k  R-EU-100K-R0603  [R0603]
R220  100k  R-EU-100K-R0603  [R0603]
R221  27R  R-EU-27R-R0603  [R0603]
R222  100k  R-EU-100K-R0603  [R0603]
R223  100k  R-EU-100K-R0603  [R0603]
R224  100k  R-EU-100K-R0603  [R0603]
R225  100k  R-EU-100K-R0603  [R0603]
R226  27R  R-EU-27R-R0603  [R0603]
R227  100k  R-EU-100K-R0603  [R0603]
R228  0R  R-EU-0R-R0603  [R0603]
R229  R-EU-R0603  [R0603]  (not fitted in variant A)  (not fitted in variant B)
R230  27R  R-EU-27R-R0603  [R0603]
R231  10k  R-EU-10K-R0603  [R0603]
R232  0R  R-EU-0R-R0603  [R0603]
R233  27R  R-EU-27R-R0603  [R0603]
R234  27R  R-EU-27R-R0603  [R0603]
R235  27R  R-EU-27R-R0603  [R0603]
R236  100k  R-EU-100K-R0603  [R0603]
R237  3k3  R-EU-3K3-R0603  [R0603]
R238  0R  R-EU-0R-R0603  [R0603]
R239  0R  R-EU-0R-R0603  [R0603]
R240  0R  R-EU-0R-R0603  [R0603]
R241  27R  R-EU-27R-R0603  [R0603]
R242  100k  R-EU-100K-R0603  [R0603]
R243  27R  R-EU-27R-R0603  [R0603]
R244  27R  R-EU-27R-R0603  [R0603]
R245  0R  R-EU-0R-R0603  [R0603]
R246  100k  R-EU-100K-R0603  [R0603]
R247  27R  R-EU-27R-R0603  [R0603]
R248  27R  R-EU-27R-R0603  [R0603]
R249  1k  R-EU-1K-R0603  [R0603]
R250  R-EU-R0603  [R0603]  (not fitted in variant A)  (not fitted in variant B)
R251  0R  R-EU-0R-R0603  [R0603]
R252  100k  R-EU-100K-R0603  [R0603]
R253  47k 0.1%  R-EU-47K-0P1-R0603  [R0603]
R254  10k 0.1%  R-EU-10K-0P1-R0603  [R0603]
R255  100k  R-EU-100K-R0603  [R0603]
R256  499R  R-EU-499R-R0402  [R0402]
R257  1k  R-EU-1K-R0603  [R0603]
R258  0R  R-EU-0R-R0603  [R0603]
R259  27R  R-EU-27R-R0603  [R0603]
R260  0R  R-EU-0R-R0603  [R0603]
R261  100k  R-EU-100K-R0603  [R0603]
R262  100k  R-EU-100K-R0603  [R0603]
R263  100k  R-EU-100K-R0603  [R0603]
R264  100k  R-EU-100K-R0603  [R0603]
R265  0R  R-EU-0R-R0603  [R0603]
R266  27R  R-EU-27R-R0603  [R0603]
R267  27R  R-EU-27R-R0603  [R0603]
R268  27R  R-EU-27R-R0603  [R0603]
R269  27R  R-EU-27R-R0603  [R0603]
R270  27R  R-EU-27R-R0603  [R0603]
R271  27R  R-EU-27R-R0603  [R0603]
R272  1k8  R-EU-1K8-R0603  [R0603]
R273  27R  R-EU-27R-R0603  [R0603]
R274  27R  R-EU-27R-R0603  [R0603]
R275  47k 0.1%  R-EU-47K-0P1-R0603  [R0603]
R276  27R  R-EU-27R-R0603  [R0603]
R277  0R  R-EU-0R-R0603  [R0603]
R278  0R  R-EU-0R-R0603  [R0603]
R279  100k  R-EU-100K-R0603  [R0603]
R280  27R  R-EU-27R-R0603  [R0603]
R281  27R  R-EU-27R-R0603  [R0603]
R282  10k  R-EU-10K-R0603  [R0603]
R283  100k  R-EU-100K-R0603  [R0603]
R284  27R  R-EU-27R-R0603  [R0603]
R285  100k  R-EU-100K-R0603  [R0603]
R286  1k8  R-EU-1K8-R0603  [R0603]
R287  1k8  R-EU-1K8-R0603  [R0603]
R288  R-EU-R0603  [R0603]  (not fitted in variant A)  (not fitted in variant B)
R289  27R  R-EU-27R-R0603  [R0603]
R290  27R  R-EU-27R-R0603  [R0603]
R291  43k  R-EU-43K-R0603  [R0603]
R292  27R  R-EU-27R-R0603  [R0603]
R293  10k 0.1%  R-EU-10K-0P1-R0603  [R0603]
R294  100k  R-EU-100K-R0603  [R0603]
R295  27R  R-EU-27R-R0603  [R0603]
R296  499R  R-EU-499R-R0402  [R0402]
R297  100k  R-EU-100K-R0603  [R0603]
R298  10k  R-EU-10K-R0603  [R0603]
R299  R-EU-R0402  [R0402]  (not fitted in variant A)  (not fitted in variant B)
R300  100k  R-EU-100K-R0603  [R0603]
R301  1k8  R-EU-1K8-R0603  [R0603]
R302  27R  R-EU-27R-R0603  [R0603]
R303  27R  R-EU-27R-R0603  [R0603]
R304  27R  R-EU-27R-R0603  [R0603]
R305  100k  R-EU-100K-R0603  [R0603]
R306  10k  R-EU-10K-R0603  [R0603]
R307  4R7  R-EU-4R7-R0402  [R0402]
R308  0R  R-EU-0R-R0603  [R0603]
R309  1k  R-EU-1K-R0603  [R0603]
R310  1k  R-EU-1K-R0603  [R0603]
R311  27R  R-EU-27R-R0603  [R0603]
R312  100k  R-EU-100K-R0603  [R0603]
R313  1M  R-EU-1M-R0603  [R0603]
R314  4R7  R-EU-4R7-R0402  [R0402]
R315  0R  R-EU-0R-R0603  [R0603]
R316  100k  R-EU-100K-R0603  [R0603]  (not fitted in variant A)  (not fitted in variant B)
R317  100k  R-EU-100K-R0603  [R0603]
R318  47k 0.1%  R-EU-47K-0P1-R0603  [R0603]
R319  100k  R-EU-100K-R0603  [R0603]
R320  100k  R-EU-100K-R0603  [R0603]
R321  27R  R-EU-27R-R0603  [R0603]
R322  27R  R-EU-27R-R0603  [R0603]
R323  100k  R-EU-100K-R0603  [R0603]
R324  27R  R-EU-27R-R0603  [R0603]
R325  10k 0.1%  R-EU-10K-0P1-R0603  [R0603]
R326  27R  R-EU-27R-R0603  [R0603]
R327  4R7  R-EU-4R7-R0402  [R0402]
R328  0R  R-EU-0R-R0603  [R0603]
R329  27R  R-EU-27R-R0603  [R0603]
R330  27R  R-EU-27R-R0603  [R0603]
R331  27R  R-EU-27R-R0603  [R0603]
R332  27R  R-EU-27R-R0603  [R0603]
R333  4R7  R-EU-4R7-R0402  [R0402]
R334  R-EU-R0603  [R0603]  (not fitted in variant A)  (not fitted in variant B)
R335  10k  R-EU-10K-R0603  [R0603]
R336  100k  R-EU-100K-R0603  [R0603]
R337  100k  R-EU-100K-R0603  [R0603]
R338  18k  R-EU-18K-R0603  [R0603]
R339  18k  R-EU-18K-R0603  [R0603]
R340  0R  R-EU-0R-R0603  [R0603]
R341  4R7  R-EU-4R7-R0402  [R0402]
R342  0R  R-EU-0R-R0603  [R0603]
R343  LVT12R0030GER  [LVT12_R003_OHMITE]
R344  18k  R-EU-18K-R0603  [R0603]
R345  27R  R-EU-27R-R0603  [R0603]
R346  27R  R-EU-27R-R0603  [R0603]
R347  3R3  R-EU-3R3-R0603  [R0603]
R348  442k  R-EU-442K-R0603  [R0603]
R349  1k8  R-EU-1K8-R0603  [R0603]
R350  1k8  R-EU-1K8-R0603  [R0603]
R351  27R  R-EU-27R-R0603  [R0603]
R352  27R  R-EU-27R-R0603  [R0603]
R353  43k  R-EU-43K-R0603  [R0603]
R354  10k  R-EU-10K-R0603  [R0603]
R355  10k  R-EU-10K-R0603  [R0603]
R356  100k  R-EU-100K-R0603  [R0603]
R357  100k  R-EU-100K-R0603  [R0603]
R358  18R  R-EU-18R-R0603  [R0603]
R359  100k  R-EU-100K-R0603  [R0603]
R360  18R  R-EU-18R-R0603  [R0603]
R361  0R  R-EU-0R-R0603  [R0603]
R362  1M  R-EU-1M-R0603  [R0603]
R363  LVT12R0050FER  [LVT12_R003_OHMITE]
R364  12k  R-EU-12K-R0603  [R0603]
R365  27R  R-EU-27R-R0603  [R0603]
R366  18k  R-EU-18K-R0603  [R0603]
R367  LVT12R0100FER  [LVT12_R003_OHMITE]
R368  100k  R-EU-100K-R0603  [R0603]
R369  43k  R-EU-43K-R0603  [R0603]
R370  3R3  R-EU-3R3-R0603  [R0603]
R371  100k  R-EU-100K-R0603  [R0603]
R372  100k  R-EU-100K-R0603  [R0603]
R373  43k  R-EU-43K-R0603  [R0603]
R374  18k  R-EU-18K-R0603  [R0603]
R375  100k  R-EU-100K-R0603  [R0603]
R376  100k  R-EU-100K-R0603  [R0603]
R377  10k  R-EU-10K-R0603  [R0603]
R378  10k  R-EU-10K-R0603  [R0603]
R379  27R  R-EU-27R-R0603  [R0603]
R380  0R  R-EU-0R-R0603  [R0603]
R381  100k  R-EU-100K-R0603  [R0603]
R382  3R3  R-EU-3R3-R1210  [R1210]
R383  100k  R-EU-100K-R0603  [R0603]
R384  3R3  R-EU-3R3-R1210  [R1210]
R385  100k  R-EU-100K-R0603  [R0603]
R386  27R  R-EU-27R-R0603  [R0603]
R387  18k  R-EU-18K-R0603  [R0603]
R388  18k  R-EU-18K-R0603  [R0603]
R389  18k  R-EU-18K-R0603  [R0603]
R390  27R  R-EU-27R-R0603  [R0603]
R391  27R  R-EU-27R-R0603  [R0603]
R392  18k  R-EU-18K-R0603  [R0603]
R393  18k  R-EU-18K-R0603  [R0603]
R394  18k  R-EU-18K-R0603  [R0603]
R395  27R  R-EU-27R-R0603  [R0603]
R396  27R  R-EU-27R-R0603  [R0603]
R397  18k  R-EU-18K-R0603  [R0603]
R398  18k  R-EU-18K-R0603  [R0603]
R399  18k  R-EU-18K-R0603  [R0603]
R400  27R  R-EU-27R-R0603  [R0603]
R401  27R  R-EU-27R-R0603  [R0603]
R402  18k  R-EU-18K-R0603  [R0603]
R403  18k  R-EU-18K-R0603  [R0603]
R404  18k  R-EU-18K-R0603  [R0603]
R405  27R  R-EU-27R-R0603  [R0603]
R406  27R  R-EU-27R-R0603  [R0603]
R407  18k  R-EU-18K-R0603  [R0603]
R408  18k  R-EU-18K-R0603  [R0603]
R409  18k  R-EU-18K-R0603  [R0603]
R410  3R3  R-EU-3R3-R1210  [R1210]
R411  3R3  R-EU-3R3-R1210  [R1210]
R412  3R3  R-EU-3R3-R1210  [R1210]
R413  3R3  R-EU-3R3-R1210  [R1210]
R414  100k  R-EU-100K-R0603  [R0603]
R415  100k  R-EU-100K-R0603  [R0603]
R416  27R  R-EU-27R-R0603  [R0603]
R417  R-EU-R0603  [R0603]  (not fitted in variant A)  (not fitted in variant B)
R418  0R  R-EU-0R-R0603  [R0603]  (not fitted in variant A)  (not fitted in variant B)
R419  10k 0.1%  R-EU-10K-0P1-R0603  [R0603]
R420  0R  R-EU-0R-R0603  [R0603]
R421  27R  R-EU-27R-R0603  [R0603]
R422  27R  R-EU-27R-R0603  [R0603]
R423  10k 0.1%  R-EU-10K-0P1-R0603  [R0603]
R424  47k 0.1%  R-EU-47K-0P1-R0603  [R0603]
R425  47k 0.1%  R-EU-47K-0P1-R0603  [R0603]
R426  10k 0.1%  R-EU-10K-0P1-R0603  [R0603]
R427  0R  R-EU-0R-R0603  [R0603]
R428  27R  R-EU-27R-R0603  [R0603]
R429  27R  R-EU-27R-R0603  [R0603]
R430  442k  R-EU-442K-R0603  [R0603]
R431  47k 0.1%  R-EU-47K-0P1-R0603  [R0603]
R432  27R  R-EU-27R-R0603  [R0603]
R433  27R  R-EU-27R-R0603  [R0603]
R434  27R  R-EU-27R-R0603  [R0603]
R435  27R  R-EU-27R-R0603  [R0603]
R436  27R  R-EU-27R-R0603  [R0603]
R437  499R  R-EU-499R-R0402  [R0402]
R438  27R  R-EU-27R-R0603  [R0603]
R439  100k  R-EU-100K-R0603  [R0603]
R440  3k3  R-EU-3K3-R0603  [R0603]
R441  0R  R-EU-0R-R0603  [R0603]
R442  27R  R-EU-27R-R0603  [R0603]
R443  27R  R-EU-27R-R0603  [R0603]
R444  100k  R-EU-100K-R0603  [R0603]
R445  100k  R-EU-100K-R0603  [R0603]
R446  1k  R-EU-1K-R0603  [R0603]
R447  100k  R-EU-100K-R0603  [R0603]
R448  27R  R-EU-27R-R0603  [R0603]
R449  1M  R-EU-1M-R0603  [R0603]
R450  3R3  R-EU-3R3-R0603  [R0603]
R451  3R3  R-EU-3R3-R0603  [R0603]
R452  0R  R-EU-0R-R0603  [R0603]
R453  3R3  R-EU-3R3-R0603  [R0603]
R454  3R3  R-EU-3R3-R0603  [R0603]
R455  0R  R-EU-0R-R0603  [R0603]
R456  0R15  R-EU-0R15-R1206  [R1206]
R457  3R3  R-EU-3R3-R0603  [R0603]
R458  3R3  R-EU-3R3-R0603  [R0603]
R459  0R  R-EU-0R-R0603  [R0603]
R460  0R  R-EU-0R-R0603  [R0603]
R461  1k  R-EU-1K-R0603  [R0603]
R462  27R  R-EU-27R-R0603  [R0603]
R463  0R  R-EU-0R-R0603  [R0603]
R464  1k  R-EU-1K-R0603  [R0603]
R465  27R  R-EU-27R-R0603  [R0603]
R466  27R  R-EU-27R-R0603  [R0603]
R467  27R  R-EU-27R-R0603  [R0603]
R468  100R  R-EU-100R-R0603  [R0603]  (not fitted in variant A)  (not fitted in variant B)
R469  0R  R-EU-0R-R0603  [R0603]  (not fitted in variant A)  (not fitted in variant B)
R470  27R  R-EU-27R-R0603  [R0603]  (not fitted in variant A)  (not fitted in variant B)
R471  27R  R-EU-27R-R0603  [R0603]
R472  27R  R-EU-27R-R0603  [R0603]
R473  27R  R-EU-27R-R0603  [R0603]
R474  R-EU-R0603  [R0603]  (not fitted in variant A)  (not fitted in variant B)
R475  27R  R-EU-27R-R0603  [R0603]
R476  27R  R-EU-27R-R0603  [R0603]
R477  27R  R-EU-27R-R0603  [R0603]
R478  27R  R-EU-27R-R0603  [R0603]
R479  27R  R-EU-27R-R0603  [R0603]  (not fitted in variant A)  (not fitted in variant B)
R480  100k  R-EU-100K-R0603  [R0603]
R481  10k  R-EU-10K-R0603  [R0603]
R482  10k  R-EU-10K-R0603  [R0603]
R483  100k  R-EU-100K-R0603  [R0603]
R484  0R  R-EU-0R-R0603  [R0603]  (not fitted in variant A)  (not fitted in variant B)
R485  0R  R-EU-0R-R0603  [R0603]  (not fitted in variant A)  (not fitted in variant B)
R486  0R  R-EU-0R-R0603  [R0603]
R487  0R  R-EU-0R-R0603  [R0603]
R488  10k 0.1%  R-EU-10K-0P1-R0603  [R0603]  (not fitted in variant A)  (not fitted in variant B)
R489  0R  R-EU-0R-R0603  [R0603]
R490  0R  R-EU-0R-R0603  [R0603]
R491  0R  R-EU-0R-R0603  [R0603]
R492  100k  R-EU-100K-R0603  [R0603]
R493  27R  R-EU-27R-R0603  [R0603]
R494  27R  R-EU-27R-R0603  [R0603]
R495  27R  R-EU-27R-R0603  [R0603]
R496  27R  R-EU-27R-R0603  [R0603]
R497  27R  R-EU-27R-R0603  [R0603]
R498  27R  R-EU-27R-R0603  [R0603]
R499  27R  R-EU-27R-R0603  [R0603]
R500  27R  R-EU-27R-R0603  [R0603]
R501  27R  R-EU-27R-R0603  [R0603]
R502  27R  R-EU-27R-R0603  [R0603]
R503  27R  R-EU-27R-R0603  [R0603]
R504  27R  R-EU-27R-R0603  [R0603]
R505  27R  R-EU-27R-R0603  [R0603]
R506  27R  R-EU-27R-R0603  [R0603]
R507  27R  R-EU-27R-R0603  [R0603]
R508  100k  R-EU-100K-R0603  [R0603]
R509  442k  R-EU-442K-R0603  [R0603]
R510  100k  R-EU-100K-R0603  [R0603]
R511  1M  R-EU-1M-R0603  [R0603]
R512  47k 0.1%  R-EU-47K-0P1-R0603  [R0603]
R513  18k  R-EU-18K-R0603  [R0603]
R514  47k 0.1%  R-EU-47K-0P1-R0603  [R0603]
R515  10k 0.1%  R-EU-10K-0P1-R0603  [R0603]
R516  27R  R-EU-27R-R0603  [R0603]
R517  27R  R-EU-27R-R0603  [R0603]
R518  27R  R-EU-27R-R0603  [R0603]
R519  0R  R-EU-0R-R0603  [R0603]  (not fitted in variant A)  (not fitted in variant B)
R520  100k  R-EU-100K-R0603  [R0603]
R521  R-EU-R0603  [R0603]  (not fitted in variant A)  (not fitted in variant B)
R522  0R  R-EU-0R-R0603  [R0603]
R523  R-EU-R0603  [R0603]  (not fitted in variant A)  (not fitted in variant B)
R524  100k  R-EU-100K-R0603  [R0603]
R525  1k  R-EU-1K-R0603  [R0603]
R526  0R  R-EU-0R-R0603  [R0603]
R527  100k  R-EU-100K-R0603  [R0603]
R528  442k  R-EU-442K-R0603  [R0603]
R529  10k 0.1%  R-EU-10K-0P1-R0603  [R0603]
R530  0R  R-EU-0R-R0603  [R0603]  (not fitted in variant A)  (not fitted in variant B)
R531  0R  R-EU-0R-R0603  [R0603]  (not fitted in variant A)  (not fitted in variant B)
R532  0R  R-EU-0R-R0603  [R0603]  (not fitted in variant A)  (not fitted in variant B)
R533  100k  R-EU-100K-R0603  [R0603]
R534  1k8  R-EU-1K8-R0603  [R0603]
R535  100k  R-EU-100K-R0603  [R0603]
R536  1k8  R-EU-1K8-R0603  [R0603]
R537  27R  R-EU-27R-R0603  [R0603]
R538  3R3  R-EU-3R3-R0603  [R0603]  (not fitted in variant A)  (not fitted in variant B)
R539  100k  R-EU-100K-R0603  [R0603]
R540  27R  R-EU-27R-R0603  [R0603]
R541  1k8  R-EU-1K8-R0603  [R0603]
R542  0R  R-EU-0R-R0603  [R0603]  (not fitted in variant A)  (not fitted in variant B)
R543  100k  R-EU-100K-R0603  [R0603]  (not fitted in variant A)  (not fitted in variant B)
R544  0R  R-EU-0R-R0603  [R0603]  (not fitted in variant A)  (not fitted in variant B)
R545  27R  R-EU-27R-R0603  [R0603]  (not fitted in variant A)  (not fitted in variant B)
R547  100k  R-EU-100K-R0603  [R0603]  (not fitted in variant A)  (not fitted in variant B)
R549  100k  R-EU-100K-R0603  [R0603]  (not fitted in variant A)  (not fitted in variant B)
R550  100k  R-EU-100K-R0603  [R0603]
R551  0R  R-EU-0R-R0603  [R0603]  (not fitted in variant A)  (not fitted in variant B)
R552  10k  R-EU-10K-R0603  [R0603]
R553  18k  R-EU-18K-R0603  [R0603]
R554  27R  R-EU-27R-R0603  [R0603]
R555  100k  R-EU-100K-R0603  [R0603]
R556  27R  R-EU-27R-R0603  [R0603]
R557  27R  R-EU-27R-R0603  [R0603]
R558  27R  R-EU-27R-R0603  [R0603]
R559  0R  R-EU-0R-R0603  [R0603]
R560  R-EU-R0603  [R0603]  (not fitted in variant A)  (not fitted in variant B)
R561  R-EU-R0603  [R0603]  (not fitted in variant A)  (not fitted in variant B)
R562  R-EU-R0603  [R0603]  (not fitted in variant A)  (not fitted in variant B)
R563  0R  R-EU-0R-R0603  [R0603]
R564  27R  R-EU-27R-R0603  [R0603]
R565  0R  R-EU-0R-R0603  [R0603]
R566  100k  R-EU-100K-R0603  [R0603]
R567  1M  R-EU-1M-R0603  [R0603]
R568  1M  R-EU-1M-R0603  [R0603]
R569  1M  R-EU-1M-R0603  [R0603]
R570  1M  R-EU-1M-R0603  [R0603]
R571  1M  R-EU-1M-R0603  [R0603]
R572  1M  R-EU-1M-R0603  [R0603]
R573  100k  R-EU-100K-R0603  [R0603]
R574  100k  R-EU-100K-R0603  [R0603]
R575  27R  R-EU-27R-R0603  [R0603]
R576  3R3  R-EU-3R3-R0603  [R0603]  (not fitted in variant A)  (not fitted in variant B)
R577  0R  R-EU-0R-R0603  [R0603]
R578  0R  R-EU-0R-R0603  [R0603]
R579  100k  R-EU-100K-R0603  [R0603]
R580  27R  R-EU-27R-R0603  [R0603]
R581  18R  R-EU-18R-R0603  [R0603]
R582  100k  R-EU-100K-R0603  [R0603]
R583  27R  R-EU-27R-R0603  [R0603]
R584  330R  R-EU-330R-R0603  [R0603]
R585  100k  R-EU-100K-R0603  [R0603]
R586  27R  R-EU-27R-R0603  [R0603]
R587  18R  R-EU-18R-R0603  [R0603]
R588  100k  R-EU-100K-R0603  [R0603]
R589  27R  R-EU-27R-R0603  [R0603]
R590  18R  R-EU-18R-R0603  [R0603]
R591  330R  R-EU-330R-R0603  [R0603]
R592  0R  R-EU-0R-R0603  [R0603]
R593  1k  R-EU-1K-R0603  [R0603]
R594  100k  R-EU-100K-R0603  [R0603]
R595  27R  R-EU-27R-R0603  [R0603]
R596  3k3  R-EU-3K3-R0603  [R0603]
R597  0R  R-EU-0R-R0603  [R0603]
R598  0R  R-EU-0R-R0603  [R0603]
R599  100k  R-EU-100K-R0603  [R0603]
R600  0R  R-EU-0R-R0603  [R0603]
R601  1k8  R-EU-1K8-R0603  [R0603]
R602  3k3  R-EU-3K3-R0603  [R0603]
R603  0R  R-EU-0R-R0603  [R0603]
R604  1k  R-EU-1K-R0603  [R0603]
R605  1M  R-EU-1M-R0603  [R0603]
R606  0R  R-EU-0R-R0603  [R0603]  (not fitted in variant A)  (not fitted in variant B)
R607  0R  R-EU-0R-R0603  [R0603]
R608  0R  R-EU-0R-R0603  [R0603]
R609  0R  R-EU-0R-R0603  [R0603]
R610  10k  R-EU-10K-R0603  [R0603]
R611  10k  R-EU-10K-R0603  [R0603]
R612  18R  R-EU-18R-R0603  [R0603]
R613  18R  R-EU-18R-R0603  [R0603]
R614  18R  R-EU-18R-R0603  [R0603]
R615  18R  R-EU-18R-R0603  [R0603]
R616  18R  R-EU-18R-R0603  [R0603]
R617  18R  R-EU-18R-R0603  [R0603]
R618  18R  R-EU-18R-R0603  [R0603]
R619  18R  R-EU-18R-R0603  [R0603]
R620  18R  R-EU-18R-R0603  [R0603]
R621  18R  R-EU-18R-R0603  [R0603]
R622  18R  R-EU-18R-R0603  [R0603]
R623  18R  R-EU-18R-R0603  [R0603]
R624  18R  R-EU-18R-R0603  [R0603]
R625  18R  R-EU-18R-R0603  [R0603]
R626  18R  R-EU-18R-R0603  [R0603]
R745  1k  R-EU-1K-R0603  [R0603]
R779  1k  R-EU-1K-R0603  [R0603]
R780  0R  R-EU-0R-R0603  [R0603]
R781  0R  R-EU-0R-R0603  [R0603]
R782  0R  R-EU-0R-R0603  [R0603]
R783  0R  R-EU-0R-R0603  [R0603]
R784  LVT12R0100FER  [LVT12_R003_OHMITE]
R785  3R3  R-EU-3R3-R0603  [R0603]
R786  3R3  R-EU-3R3-R0603  [R0603]
R787  0R  R-EU-0R-R0603  [R0603]
R788  442k  R-EU-442K-R0603  [R0603]
R789  27R  R-EU-27R-R0603  [R0603]
R790  10k  R-EU-10K-R0603  [R0603]
R791  27k  R-EU-27K-R0603  [R0603]
R792  0R  R-EU-0R-R0603  [R0603]  (not fitted in variant A)  (not fitted in variant B)
R793  0R  R-EU-0R-R0603  [R0603]
R794  0R  R-EU-0R-R0603  [R0603]
R973  10k 0.1%  R-EU-10K-0P1-R0603  [R0603]
R975  10k 0.1%  R-EU-10K-0P1-R0603  [R0603]
R983  47k 0.1%  R-EU-47K-0P1-R0603  [R0603]
SPACER1  9774065151  [WA-SMSI_9774065151_WUERTH]
SPACER2  9774065151  [WA-SMSI_9774065151_WUERTH]
SPACER3  9774025360  [WA-SMSI_9774025360_WUERTH]
SPACER4  9774025360  [WA-SMSI_9774025360_WUERTH]
SPACER5  9774025360  [WA-SMSI_9774025360_WUERTH]
SPACER6  9774025360  [WA-SMSI_9774025360_WUERTH]
SPACER7  9774060360  [WA-SMSI_9774060360_WUERTH]
SPACER8  n.m.  9774060360  [WA-SMSI_9774060360_WUERTH]  (not fitted in variant A)  (not fitted in variant B)
SPACER9  9774025360  [WA-SMSI_9774025360_WUERTH]
SPACER10  9774025360  [WA-SMSI_9774025360_WUERTH]
SPACER11  9774025360  [WA-SMSI_9774025360_WUERTH]
SPACER12  9774025360  [WA-SMSI_9774025360_WUERTH]
SPACER13  9774060360  [WA-SMSI_9774060360_WUERTH]
T1  DMG1012UW-7  [SOT-323_DIODES_INC]
T2  DMG1012UW-7  [SOT-323_DIODES_INC]
T3  DMP2006UFG  [POWERDI3333-8_DIODES_INC]
T4  PMF170XP  [SOT-323_SC-70_NXP]
T5  DMG1012UW-7  [SOT-323_DIODES_INC]
T6  DMG1012UW-7  [SOT-323_DIODES_INC]
T7  DMG1012UW-7  [SOT-323_DIODES_INC]
T8  NX7002AK  [SOT-23_NXP]
T9  CSD18512Q5B  [Q5B_TI]
T10  DMG1012UW-7  [SOT-323_DIODES_INC]
T11  DMG1012UW-7  [SOT-323_DIODES_INC]
T12  NX7002AK  [SOT-23_NXP]
T13  DMG1012UW-7  [SOT-323_DIODES_INC]
T14  DMG1012UW-7  [SOT-323_DIODES_INC]
T15  CSD18504Q5A  [Q5A_TI]
T16  CSD18512Q5B  [Q5B_TI]
T17  DMG1012UW-7  [SOT-323_DIODES_INC]  (not fitted in variant A)  (not fitted in variant B)
T18  NX7002AK  [SOT-23_NXP]
T19  CSD15571Q2  [Q2_TI]
T20  CSD15571Q2  [Q2_TI]
T21  DMP2006UFG  [POWERDI3333-8_DIODES_INC]
T22  DMG1012UW-7  [SOT-323_DIODES_INC]
T23  DMG1012UW-7  [SOT-323_DIODES_INC]
T24  PMF170XP  [SOT-323_SC-70_NXP]
T25  DMG1012UW-7  [SOT-323_DIODES_INC]
T26  DMG1012UW-7  [SOT-323_DIODES_INC]
T27  DMG1012UW-7  [SOT-323_DIODES_INC]
T28  DMG1012UW-7  [SOT-323_DIODES_INC]
T29  PMF170XP  [SOT-323_SC-70_NXP]
T30  DMG1012UW-7  [SOT-323_DIODES_INC]
T31  DMG1012UW-7  [SOT-323_DIODES_INC]
T32  DMG1012UW-7  [SOT-323_DIODES_INC]
T33  DMG1012UW-7  [SOT-323_DIODES_INC]
T34  NX7002AK  [SOT-23_NXP]
T35  DMG1012UW-7  [SOT-323_DIODES_INC]
T36  NX7002AK  [SOT-23_NXP]
T37  DMG1012UW-7  [SOT-323_DIODES_INC]
T38  DMG1012UW-7  [SOT-323_DIODES_INC]
T39  NX7002AK  [SOT-23_NXP]
T40  NX7002AK  [SOT-23_NXP]
T41  DMG1012UW-7  [SOT-323_DIODES_INC]
T42  DMG1012UW-7  [SOT-323_DIODES_INC]
T43  DMG1012UW-7  [SOT-323_DIODES_INC]
T44  NX7002AK  [SOT-23_NXP]
T45  NX7002AK  [SOT-23_NXP]
T46  NX7002AK  [SOT-23_NXP]
T47  DMG1012UW-7  [SOT-323_DIODES_INC]
T48  DMG1012UW-7  [SOT-323_DIODES_INC]
T49  PMF170XP  [SOT-323_SC-70_NXP]
T50  DMG1012UW-7  [SOT-323_DIODES_INC]
T51  PMV30ENEA  [SOT-23_NXP]
T52  PMV30ENEA  [SOT-23_NXP]
T53  PMV30ENEA  [SOT-23_NXP]
T54  PMV30ENEA  [SOT-23_NXP]
T55  DMG1012UW-7  [SOT-323_DIODES_INC]
T56  NX7002AK  [SOT-23_NXP]
T57  NX7002AK  [SOT-23_NXP]
T58  NX7002AK  [SOT-23_NXP]  (not fitted in variant A)  (not fitted in variant B)
T59  DMG1012UW-7  [SOT-323_DIODES_INC]
T60  DMG1012UW-7  [SOT-323_DIODES_INC]
T61  CSD18504Q5A  [Q5A_TI]
T62  CSD18512Q5B  [Q5B_TI]
T63  NX7002AK  [SOT-23_NXP]
T64  NX7002AK  [SOT-23_NXP]
T65  NX7002AK  [SOT-23_NXP]
T66  NX7002AK  [SOT-23_NXP]
T67  DMP2006UFG  [POWERDI3333-8_DIODES_INC]
T68  DMG1012UW-7  [SOT-323_DIODES_INC]
T69  PMF170XP  [SOT-323_SC-70_NXP]
T70  NX7002AK  [SOT-23_NXP]
T71  NX7002AK  [SOT-23_NXP]
T72  NX7002AK  [SOT-23_NXP]
T73  NX7002AK  [SOT-23_NXP]
T74  NX7002AK  [SOT-23_NXP]
T75  NX7002AK  [SOT-23_NXP]
T76  NX7002AK  [SOT-23_NXP]
T77  NX7002AK  [SOT-23_NXP]
T78  NX7002AK  [SOT-23_NXP]
T79  NX7002AK  [SOT-23_NXP]
T80  NX7002AK  [SOT-23_NXP]
T81  NX7002AK  [SOT-23_NXP]
T82  NX7002AK  [SOT-23_NXP]
T86  NX7002AK  [SOT-23_NXP]
TP1  TESTPOINT_VIA_ROUND_0.8MM  [TESTVIA_ROUND_0.8MM]
TP2  TESTPOINT_VIA_ROUND_0.8MM  [TESTVIA_ROUND_0.8MM]
TP3  TESTPOINT_VIA_ROUND_0.8MM  [TESTVIA_ROUND_0.8MM]
TP4  TESTPOINT_VIA_ROUND_0.8MM  [TESTVIA_ROUND_0.8MM]
TP5  TESTPOINT_VIA_ROUND_0.8MM  [TESTVIA_ROUND_0.8MM]
TP6  TESTPOINT_VIA_ROUND_0.8MM  [TESTVIA_ROUND_0.8MM]
TP7  TESTPOINT_VIA_ROUND_0.8MM  [TESTVIA_ROUND_0.8MM]
TP8  TESTPOINT_VIA_ROUND_0.8MM  [TESTVIA_ROUND_0.8MM]
TP9  TESTPOINT_VIA_ROUND_0.8MM  [TESTVIA_ROUND_0.8MM]